# Altium project SAM3X-EK_REVB.PrjPcb (part 2 of 2)

## Sheet 03_ATSAM3X_LFBGA217.SchDoc
size 420 x 297 mm
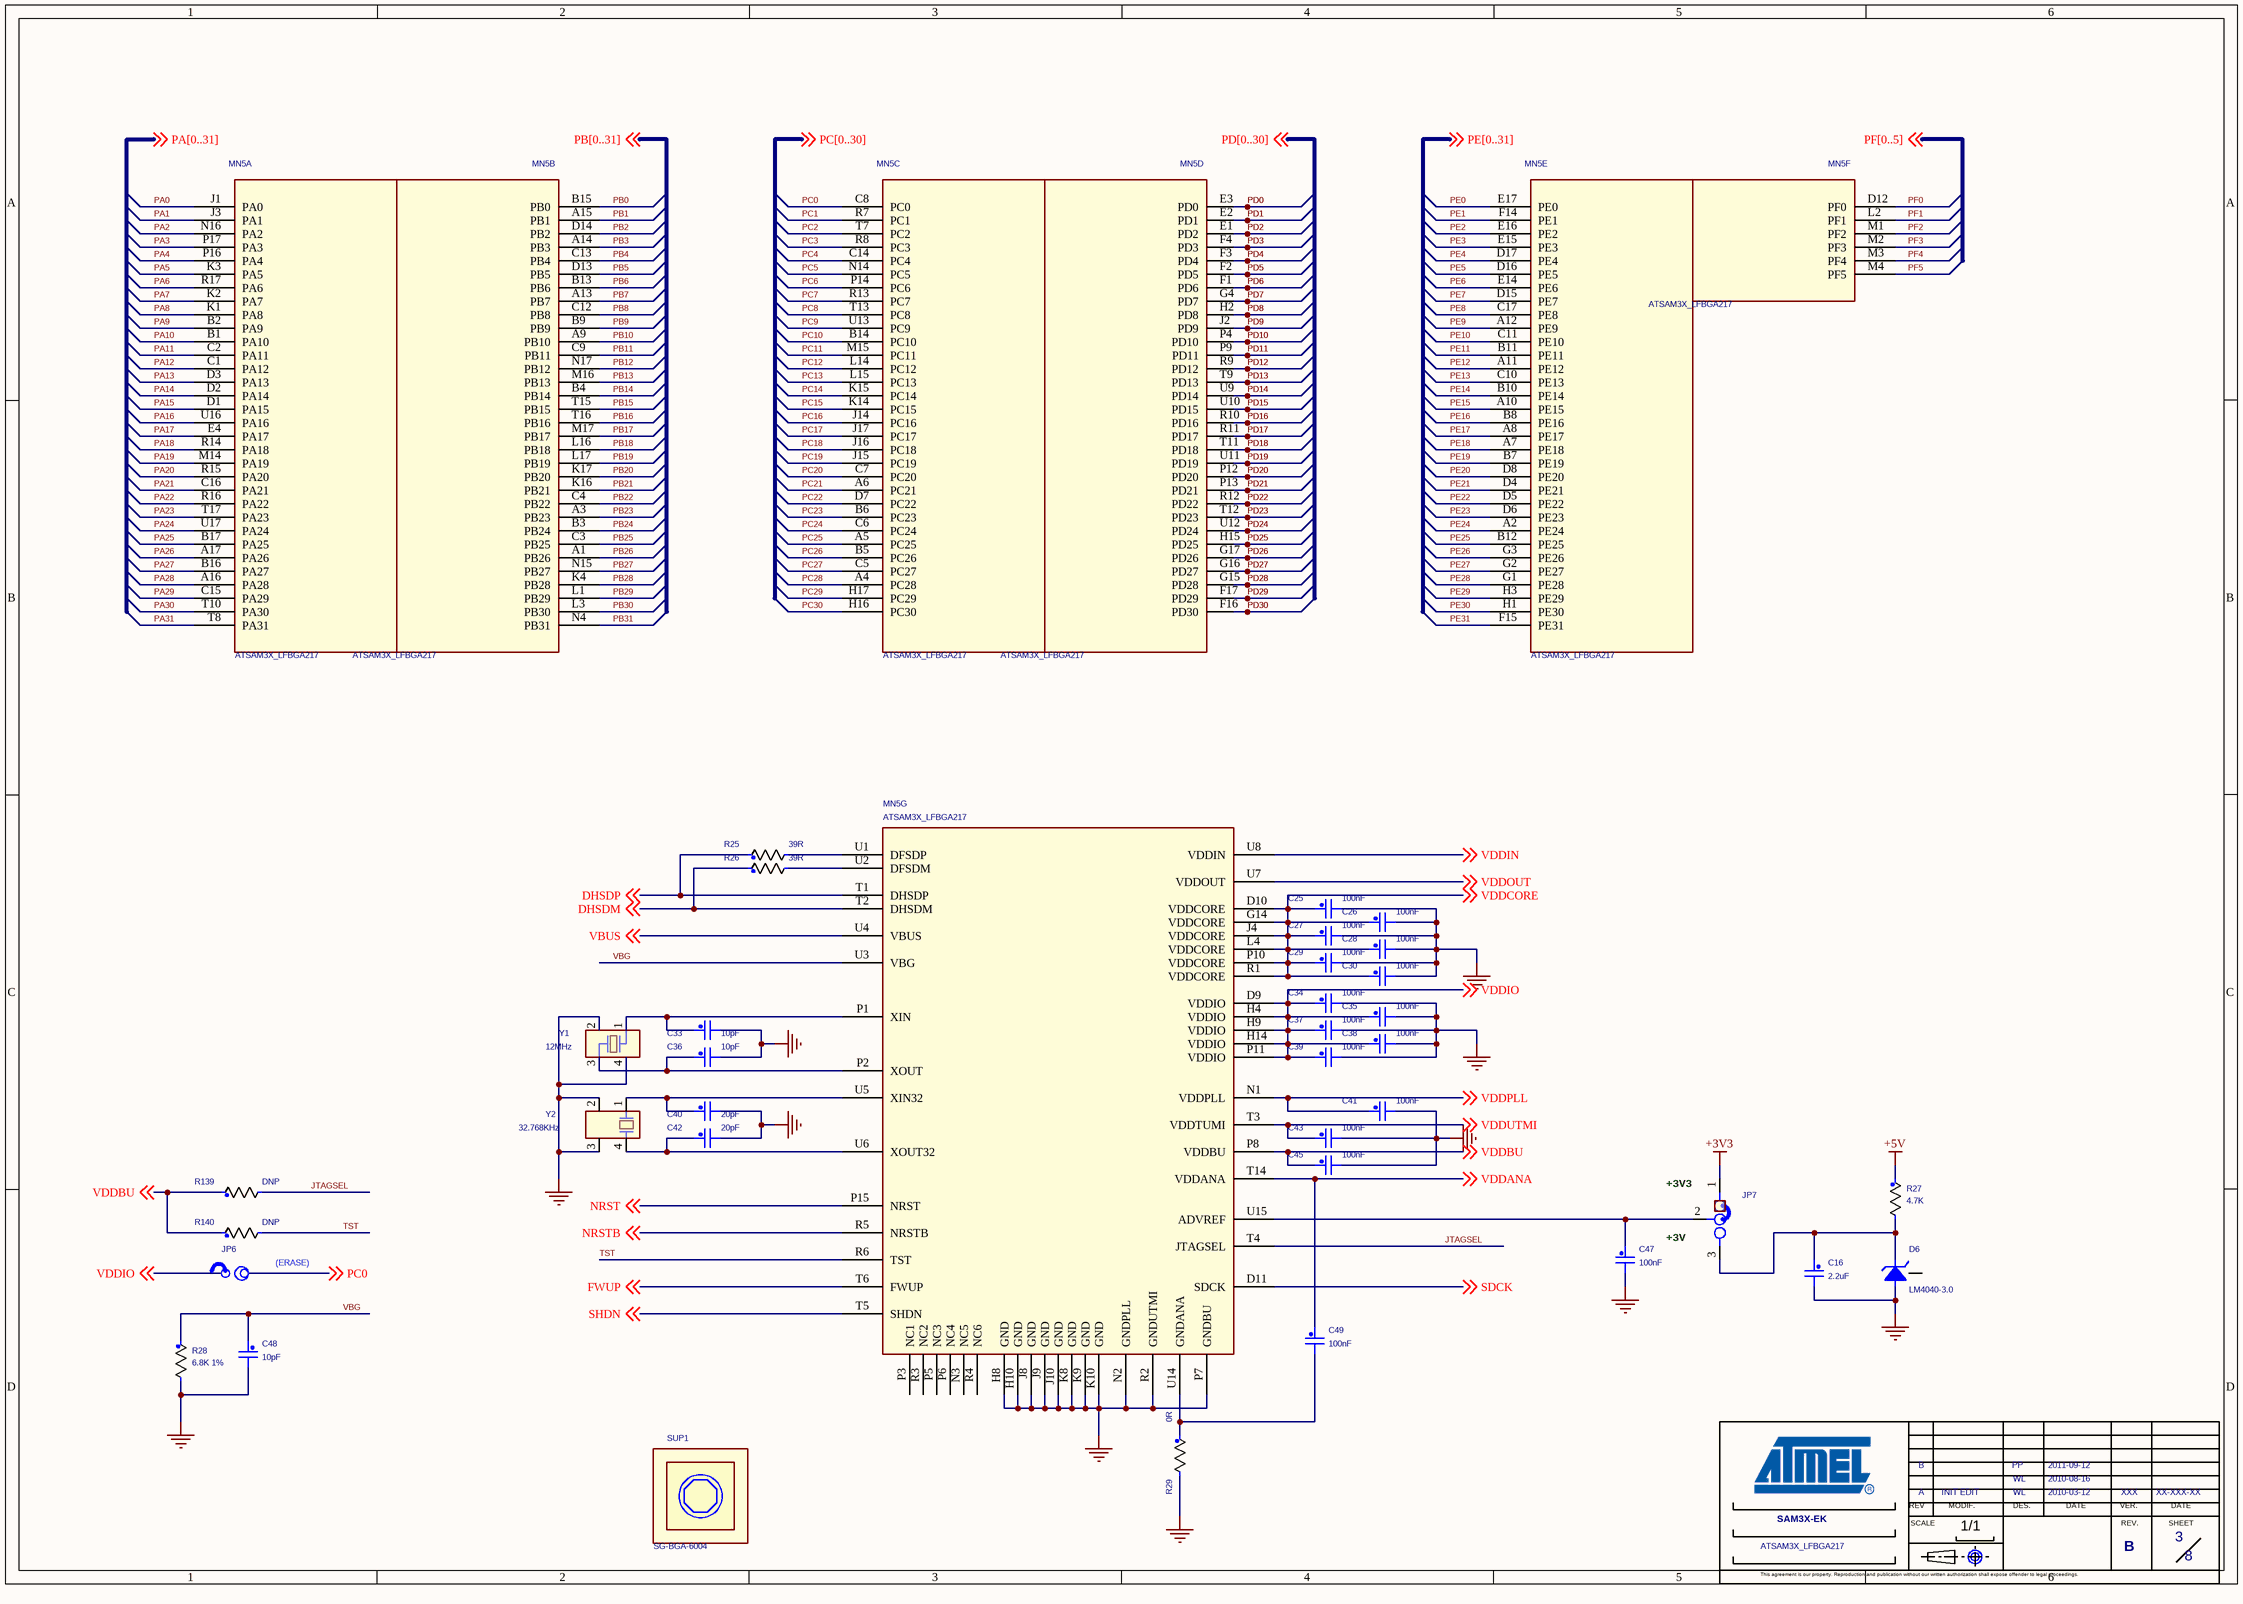
[diagram p5: 03_ATSAM3X_LFBGA217.SchDoc]

### Parts
(Parts that share a designator on the sheet are numbered #1, #2 ... from top to bottom, then left to right.)
*#6  SHEET NAME 1: ATSAM3X_LFBGA217  REV C: B  VERIF A: XXX  VERIF DATE A: XX-XXX-XX  Page Count: 8  Page Number: 3  DATE A: 2010-03-12  DATE B: 2010-08-16  DATE C: 2011-09-12  DES A: WL  DES C: PP  BOARD NAME: SAM3X-EK  VERSION: A  MODIF. DESCRIBE: INIT EDIT  (hidden comment: ATMEL ARM)  (graphical)
C16  2.2uF  [CAP0805]
C25  100nF  [CAP0805]
C26  100nF  [CAP0805]
C27  100nF  [CAP0805]
C28  100nF  [CAP0805]
C29  100nF  [CAP0805]
C30  100nF  [CAP0805]
C33  10pF  [CAP0805]
C34  100nF  [CAP0805]
C35  100nF  [CAP0805]
C36  10pF  [CAP0805]
C37  100nF  [CAP0805]
C38  100nF  [CAP0805]
C39  100nF  [CAP0805]
C40  20pF  [CAP0805]
C41  100nF  [CAP0805]
C42  20pF  [CAP0805]
C43  100nF  [CAP0805]
C45  100nF  [CAP0805]
C47  100nF  [CAP0805]
C48  10pF  [CAP0805]
C49  100nF  [CAP0805]
D6  LM4040-3.0  [SOT-23]
JP6  JP  [BAR2PTS02]  (value not drawn)
JP7  header3-100  [BAR3PTS02]  (value not drawn)
MN5  ATSAM3X_LFBGA217  [LFBGA217]  (parts A,B,C,D,E,F,G of 7)
R25  39R  [R0603]
R26  39R  [R0603]
R27  4.7K  [R0603]
R28  6.8K 1%  [R0603]
R29  0R  [r0603]
R139  DNP  [r0603]
R140  DNP  [r0603]
SH12  Jumper Pitch 2.54  [JUMPER-2.54]  (value not drawn)
SH13  Jumper Pitch 2.54  [JUMPER-2.54]  (value not drawn)
SUP1  VAL: SG-BGA-6004  (hidden comment: Support_SG-BGA-6004-MF)
Y1  12MHz  [Y6035]
Y2  32.768KHz  [9H-T7]

### Nets
+3V3: JP7.1
+5V: R27.1
GND_POWER: C16.2 C25.2 C26.2 C27.2 C28.2 C29.2 C30.2 C33.2 C34.2 C35.2 C36.2 C37.2 C38.2 C39.2 C40.2 C41.2 C42.2 C43.2 C45.2 C47.2 C48.2 D6.2(-) MN5.H8(GND) MN5.H10(GND) MN5.J8(GND) MN5.J9(GND) MN5.J10(GND) MN5.K8(GND) MN5.K9(GND) MN5.K10(GND) MN5.N2(GNDPLL) MN5.P7(GNDBU) MN5.R2(GNDUTMI) R28.2 R29.2 Y1.2 Y1.4 Y2.2 Y2.3
DHSDM: MN5.T2(DHSDM) R26.1 ; off-sheet DHSDM
DHSDP: MN5.T1(DHSDP) R25.1 ; off-sheet DHSDP
FWUP: MN5.T6(FWUP) ; off-sheet FWUP
JTAGSEL: MN5.T4(JTAGSEL) R139.2
NRST: MN5.P15(NRST) ; off-sheet NRST
NRSTB: MN5.R5(NRSTB) ; off-sheet NRSTB
PA0: MN5.J1(PA0)
PA1: MN5.J3(PA1)
PA2: MN5.N16(PA2)
PA3: MN5.P17(PA3)
PA4: MN5.P16(PA4)
PA5: MN5.K3(PA5)
PA6: MN5.R17(PA6)
PA7: MN5.K2(PA7)
PA8: MN5.K1(PA8)
PA9: MN5.B2(PA9)
PA10: MN5.B1(PA10)
PA11: MN5.C2(PA11)
PA12: MN5.C1(PA12)
PA13: MN5.D3(PA13)
PA14: MN5.D2(PA14)
PA15: MN5.D1(PA15)
PA16: MN5.U16(PA16)
PA17: MN5.E4(PA17)
PA18: MN5.R14(PA18)
PA19: MN5.M14(PA19)
PA20: MN5.R15(PA20)
PA21: MN5.C16(PA21)
PA22: MN5.R16(PA22)
PA23: MN5.T17(PA23)
PA24: MN5.U17(PA24)
PA25: MN5.B17(PA25)
PA26: MN5.A17(PA26)
PA27: MN5.B16(PA27)
PA28: MN5.A16(PA28)
PA29: MN5.C15(PA29)
PA30: MN5.T10(PA30)
PA31: MN5.T8(PA31)
PB0: MN5.B15(PB0)
PB1: MN5.A15(PB1)
PB2: MN5.D14(PB2)
PB3: MN5.A14(PB3)
PB4: MN5.C13(PB4)
PB5: MN5.D13(PB5)
PB6: MN5.B13(PB6)
PB7: MN5.A13(PB7)
PB8: MN5.C12(PB8)
PB9: MN5.B9(PB9)
PB10: MN5.A9(PB10)
PB11: MN5.C9(PB11)
PB12: MN5.N17(PB12)
PB13: MN5.M16(PB13)
PB14: MN5.B4(PB14)
PB15: MN5.T15(PB15)
PB16: MN5.T16(PB16)
PB17: MN5.M17(PB17)
PB18: MN5.L16(PB18)
PB19: MN5.L17(PB19)
PB20: MN5.K17(PB20)
PB21: MN5.K16(PB21)
PB22: MN5.C4(PB22)
PB23: MN5.A3(PB23)
PB24: MN5.B3(PB24)
PB25: MN5.C3(PB25)
PB26: MN5.A1(PB26)
PB27: MN5.N15(PB27)
PB28: MN5.K4(PB28)
PB29: MN5.L1(PB29)
PB30: MN5.L3(PB30)
PB31: MN5.N4(PB31)
PC0: JP6.1 MN5.C8(PC0) ; off-sheet PC0
PC1: MN5.R7(PC1)
PC2: MN5.T7(PC2)
PC3: MN5.R8(PC3)
PC4: MN5.C14(PC4)
PC5: MN5.N14(PC5)
PC6: MN5.P14(PC6)
PC7: MN5.R13(PC7)
PC8: MN5.T13(PC8)
PC9: MN5.U13(PC9)
PC10: MN5.B14(PC10)
PC11: MN5.M15(PC11)
PC12: MN5.L14(PC12)
PC13: MN5.L15(PC13)
PC14: MN5.K15(PC14)
PC15: MN5.K14(PC15)
PC16: MN5.J14(PC16)
PC17: MN5.J17(PC17)
PC18: MN5.J16(PC18)
PC19: MN5.J15(PC19)
PC20: MN5.C7(PC20)
PC21: MN5.A6(PC21)
PC22: MN5.D7(PC22)
PC23: MN5.B6(PC23)
PC24: MN5.C6(PC24)
PC25: MN5.A5(PC25)
PC26: MN5.B5(PC26)
PC27: MN5.C5(PC27)
PC28: MN5.A4(PC28)
PC29: MN5.H17(PC29)
PC30: MN5.H16(PC30)
PD0: MN5.E3(PD0)
PD1: MN5.E2(PD1)
PD2: MN5.E1(PD2)
PD3: MN5.F4(PD3)
PD4: MN5.F3(PD4)
PD5: MN5.F2(PD5)
PD6: MN5.F1(PD6)
PD7: MN5.G4(PD7)
PD8: MN5.H2(PD8)
PD9: MN5.J2(PD9)
PD10: MN5.P4(PD10)
PD11: MN5.P9(PD11)
PD12: MN5.R9(PD12)
PD13: MN5.T9(PD13)
PD14: MN5.U9(PD14)
PD15: MN5.U10(PD15)
PD16: MN5.R10(PD16)
PD17: MN5.R11(PD17)
PD18: MN5.T11(PD18)
PD19: MN5.U11(PD19)
PD20: MN5.P12(PD20)
PD21: MN5.P13(PD21)
PD22: MN5.R12(PD22)
PD23: MN5.T12(PD23)
PD24: MN5.U12(PD24)
PD25: MN5.H15(PD25)
PD26: MN5.G17(PD26)
PD27: MN5.G16(PD27)
PD28: MN5.G15(PD28)
PD29: MN5.F17(PD29)
PD30: MN5.F16(PD30)
PE0: MN5.E17(PE0)
PE1: MN5.F14(PE1)
PE2: MN5.E16(PE2)
PE3: MN5.E15(PE3)
PE4: MN5.D17(PE4)
PE5: MN5.D16(PE5)
PE6: MN5.E14(PE6)
PE7: MN5.D15(PE7)
PE8: MN5.C17(PE8)
PE9: MN5.A12(PE9)
PE10: MN5.C11(PE10)
PE11: MN5.B11(PE11)
PE12: MN5.A11(PE12)
PE13: MN5.C10(PE13)
PE14: MN5.B10(PE14)
PE15: MN5.A10(PE15)
PE16: MN5.B8(PE16)
PE17: MN5.A8(PE17)
PE18: MN5.A7(PE18)
PE19: MN5.B7(PE19)
PE20: MN5.D8(PE20)
PE21: MN5.D4(PE21)
PE22: MN5.D5(PE22)
PE23: MN5.D6(PE23)
PE24: MN5.A2(PE24)
PE25: MN5.B12(PE25)
PE26: MN5.G3(PE26)
PE27: MN5.G2(PE27)
PE28: MN5.G1(PE28)
PE29: MN5.H3(PE29)
PE30: MN5.H1(PE30)
PE31: MN5.F15(PE31)
PF0: MN5.D12(PF0)
PF1: MN5.L2(PF1)
PF2: MN5.M1(PF2)
PF3: MN5.M2(PF3)
PF4: MN5.M3(PF4)
PF5: MN5.M4(PF5)
SDCK: MN5.D11(SDCK) ; off-sheet SDCK
SHDN: MN5.T5(SHDN) ; off-sheet SHDN
TST: MN5.R6(TST) R140.2
VBG: C48.1 MN5.U3(VBG) R28.1
VBUS: MN5.U4(VBUS) ; off-sheet VBUS
VDDANA: C49.1 MN5.T14(VDDANA) ; off-sheet VDDANA
VDDBU: C45.1 MN5.P8(VDDBU) R139.1 R140.1 ; off-sheet VDDBU
VDDCORE: C25.1 C26.1 C27.1 C28.1 C29.1 C30.1 MN5.D10(VDDCORE) MN5.G14(VDDCORE) MN5.J4(VDDCORE) MN5.L4(VDDCORE) MN5.P10(VDDCORE) MN5.R1(VDDCORE) ; off-sheet VDDCORE
VDDIN: MN5.U8(VDDIN) ; off-sheet VDDIN
VDDIO: C34.1 C35.1 C37.1 C38.1 C39.1 JP6.2 MN5.D9(VDDIO) MN5.H4(VDDIO) MN5.H9(VDDIO) MN5.H14(VDDIO) MN5.P11(VDDIO) ; off-sheet VDDIO
VDDOUT: MN5.U7(VDDOUT) ; off-sheet VDDOUT
VDDPLL: C41.1 MN5.N1(VDDPLL) ; off-sheet VDDPLL
VDDUTMI: C43.1 MN5.T3(VDDTUMI) ; off-sheet VDDUTMI
NetC16_1: C16.1 D6.1(+) JP7.3 R27.2
NetC33_1: C33.1 MN5.P1(XIN) Y1.1
NetC36_1: C36.1 MN5.P2(XOUT) Y1.3
NetC40_1: C40.1 MN5.U5(XIN32) Y2.1
NetC42_1: C42.1 MN5.U6(XOUT32) Y2.4
NetC47_1: C47.1 JP7.2 MN5.U15(ADVREF)
NetC49_2: C49.2 MN5.U14(GNDANA) R29.1
NetMN5_U1: MN5.U1(DFSDP) R25.2
NetMN5_U2: MN5.U2(DFSDM) R26.2

Not connected (* = marked no-connect by the designer): D6 3(NC); MN5 N3(NC5) P3(NC1) P5(NC3) P6(NC4) R3(NC2) R4(NC6)

### Notes on the sheet
- (near JP7) +3V3
- (ERASE)
- (near JP7) +3V
- (in symbol ATMEL ARM) REV; MODIF.; DES.; DATE; VER.; SCALE; REV.; SHEET; 1/1; This agreement is our property. Reproduction and publication without our written authorization shall expose offender to legal proceedings.

### Library data of the parts
*#6 = ATMEL ARM: REV D: D; REV F: F; REV E: E; REV B: B; VERIF F: XXX; VERIF E: XXX; VERIF D: XXX; VERIF C: XXX; VERIF B: XXX; VERIF DATE F: XX-XXX-XX; VERIF DATE E: XX-XXX-XX; VERIF DATE D: XX-XXX-XX; VERIF DATE C: XX-XXX-XX; REV: B; VERIF DATE B: XX-XXX-XX; FT: ?; Page Size: A; Page Create Date: june 19, 2004; DATE D: XX-XXX-XX; DATE E: XX-XXX-XX; DATE F: XX-XXX-XX; DES E: XXX; DES F: XXX; DES B: WL; DES D: XXX
C16 = C_Generic: Toler.: 10%; P/N #1: C0603C104K4RAC; Voltage: 50V; Mfg #1: KEMET; Dielectric: X5R; REF: C2012X5R1C225KT; FAB: TDK; DEV: C0805; DESIG: X5R CERAMIC CAPACITOR; BOI: 0805; TOL: 10%; TEN: 50V; VAL: 2.2uF
C25 C27 C29 C35 C38 C41 C43 C49 = C_Generic: as C119 on sheet 08_SERIAL & USER INTERF; TOL: 10%; TEN: 16V; VAL: 100nF
C26 C28 C30 C34 C37 C39 C45 C47 = C_Generic: as C120 on sheet 08_SERIAL & USER INTERF; VAL: 100nF; TEN: 16V; TOL: 10%
C33 C36 C48 = C_Generic: Toler.: 10%; P/N #1: C0603C104K4RAC; Voltage: 16V; Mfg #1: KEMET; Dielectric: X7R; BOI: 0603; DESIG: Ceramic capacitor; DEV: C0603; FAB: TDK; REF: C1608X7R1H100KT; TEN: 50V; VAL: 10pF; TOL: 10%
C40 C42 = C_Generic: Toler.: 10%; P/N #1: C0603C104K4RAC; Voltage: 16V; Mfg #1: KEMET; Dielectric: X7R; TEN: 50V; REF: C1608X7R1H200KT; FAB: TDK; DEV: C0603; DESIG: Ceramic capacitor; BOI: 0603; TOL: 10%; VAL: 20pF
D6 = LM4040: Note: 0603; VAL: LM4040AIM3X-3.0; DESIG: Precision Micropower Shunt Voltage Reference; FAB: National; DEV: SOT23; REF: LM4040AIM3X-3.0; BOI: SOT23
JP6 = JUMP_0: as JP14 on sheet 08_SERIAL & USER INTERF; VAL: 045
JP7 = TSW 3PTS-DROIT_0: DESIG: Single Row Terminal Strips; BOI: TSW; FAB: SAMTEC; RoHS: YES; DEV: HEADER3-100; REF: header3-100; VAL: header3-100; PN: header3-100
R25 = R_Generic: Toler.: 1%; P/N #1: CR10-1001F-T; Mfg #1: AVX; TOL: 5%; REF: RC0603JR-0739RL; FAB: YAGEO; DESIG: RC21 5%; BOI: 0603; VAL: 39R; DEV: R0603
R26 = R_Generic: Toler.: 1%; P/N #1: CR10-1001F-T; Mfg #1: AVX; BOI: 0603; DESIG: RC21 5%; FAB: YAGEO; REF: RC0603JR-0739RL; TOL: 5%; DEV: R0603; VAL: 39R
R27 = R_Generic: P/N #1: CR10-1001F-T; BOI: 0603; DESIG: RC21 5%; FAB: YAGEO; REF: RC0603JR-074K7L; TOL: 5%; DEV: R0603; VAL: 4.7K
R28 = R_Generic: P/N #1: CR10-1001F-T; REF: RC0603FR-076K8L; FAB: YAGEO; DESIG: RC22H 1%; BOI: 0603; TOL: 1%; VAL: 6.8K; DEV: R0603
R29 = R_Generic: as R113 on sheet 08_SERIAL & USER INTERF; DEV: R0603; VAL: 0R
R139 R140 = R_Generic: P/N #1: CR10-1001F-T; TOL: 5%; VAL: NOT POPULATED; FAB: YAGEO; DESIG: RC21 5%; BOI: 0603; DEV: R0603
SH12 = JUMPER-2.54: as SH20 on sheet 08_SERIAL & USER INTERF; DESIG: 2 POINTS JUMPER PITCH 2.54; VAL: JUMPER 2.54; BOI: NA; Part Type: Jumper
SH13 = JUMPER-2.54: as SH23 on sheet 08_SERIAL & USER INTERF; DESIG: 2 POINTS JUMPER PITCH 2.54; VAL: JUMPER 2.54; BOI: NA; Part Type: Jumper
SUP1 = Support_SG-BGA-6004-MF: FAB: Ironwood Electronics; BOI: Voir Specif. Techniq; DESIG: BGA Sockets-0.8mm; REF: SG-BGA-6004-MF
Y1 = 12MHz: FAB: ECEC; REF: K12000L035
Y2 = 32.768KHz: FAB: TXC

## Sheet 02_POWER SUPPLY & USB &.SchDoc
size 420 x 297 mm
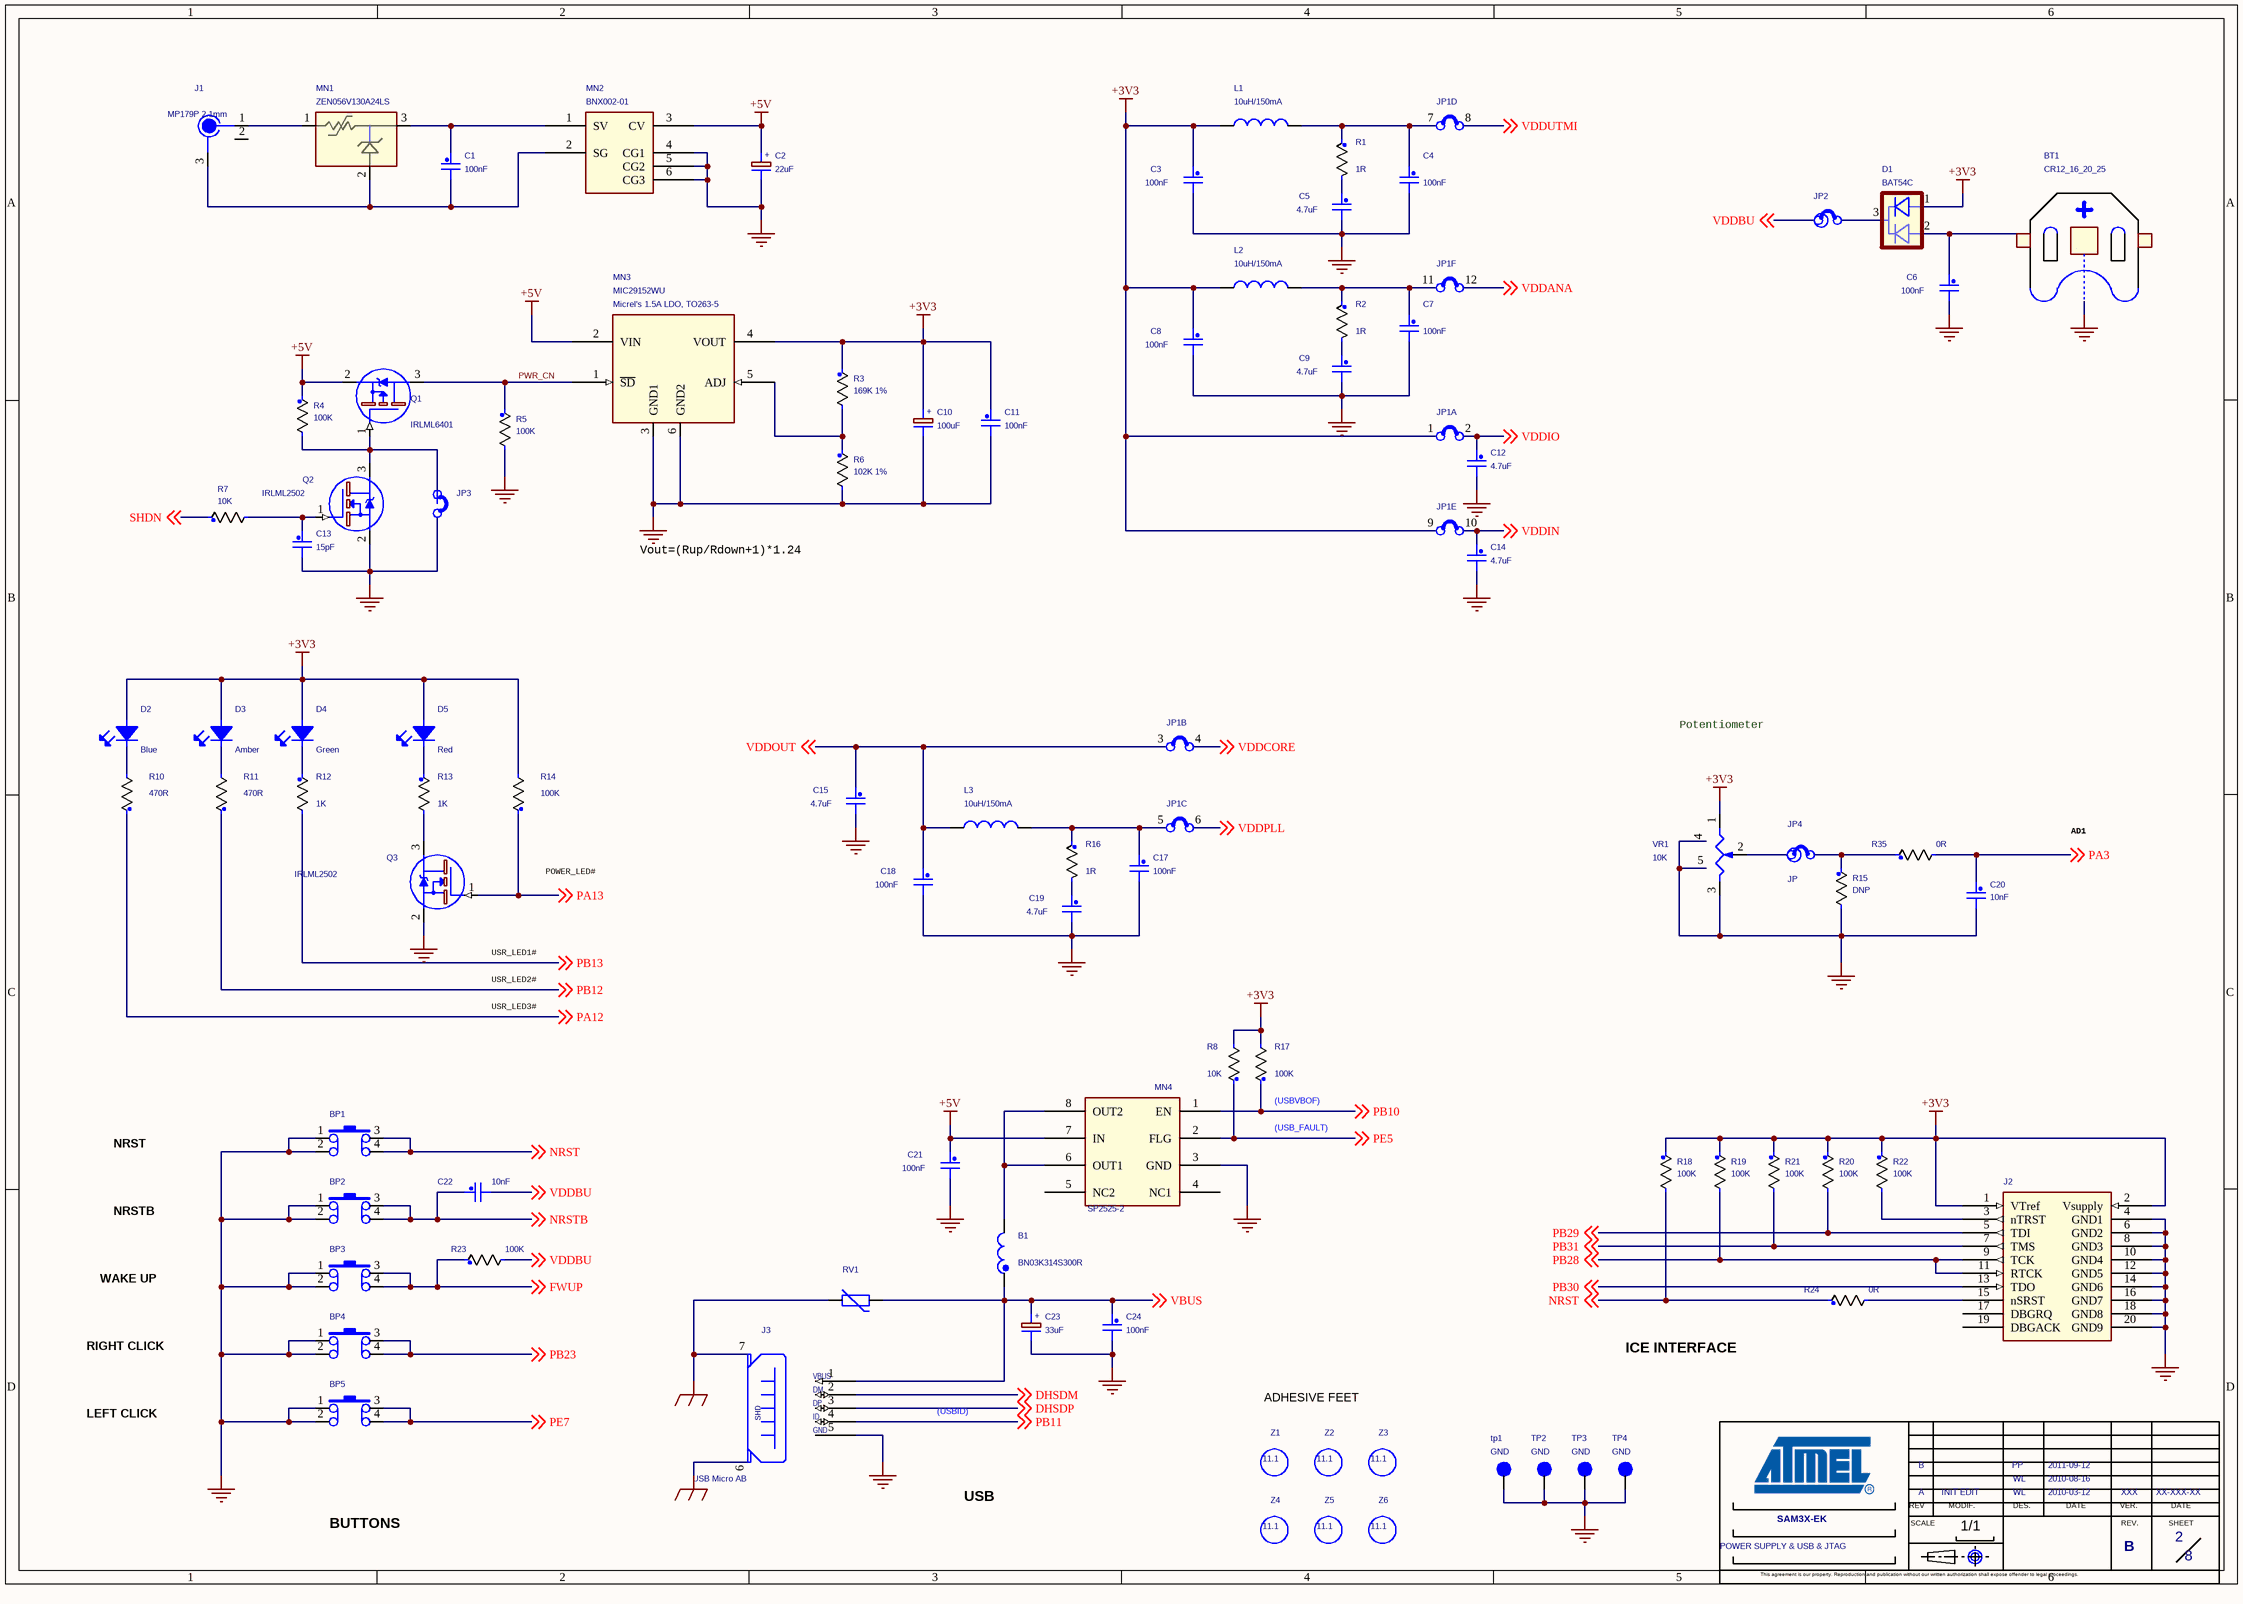
[diagram p6: 02_POWER SUPPLY & USB &.SchDoc]

### Parts
(Parts that share a designator on the sheet are numbered #1, #2 ... from top to bottom, then left to right.)
*#7  SHEET NAME 1: POWER SUPPLY & USB & JTAG  REV C: B  VERIF A: XXX  VERIF DATE A: XX-XXX-XX  Page Count: 8  Page Number: 2  DATE A: 2010-03-12  DATE B: 2010-08-16  DATE C: 2011-09-12  DES A: WL  DES C: PP  BOARD NAME: SAM3X-EK  VERSION: A  MODIF. DESCRIBE: INIT EDIT  (hidden comment: ATMEL ARM)  (graphical)
B1  BN03K314S300R  [R0603]
BP1  T062  [KEY]  (value not drawn)
BP2  T062  [KEY]  (value not drawn)
BP3  T062  [KEY]  (value not drawn)
BP4  T062  [KEY]  (value not drawn)
BP5  T062  [KEY]  (value not drawn)
BT1  CR12_16_20_25  [x-s_3000_01]
C1  100nF  [CAP0805]
C2  22uF  [C3528-21]
C3  100nF  [CAP0805]
C4  100nF  [CAP0805]
C5  4.7uF  [CAP0805]
C6  100nF  [CAP0805]
C7  100nF  [CAP0805]
C8  100nF  [CAP0805]
C9  4.7uF  [CAP0805]
C10  100uF  [C3528-21]
C11  100nF  [CAP0805]
C12  4.7uF  [CAP0805]
C13  15pF  [CAP0805]
C14  4.7uF  [CAP0805]
C15  4.7uF  [CAP0805]
C17  100nF  [CAP0805]
C18  100nF  [CAP0805]
C19  4.7uF  [CAP0805]
C20  10nF  [CAP0805]
C21  100nF  [CAP0805]
C22  10nF  [CAP0805]
C23  33uF  [C3528-21]
C24  100nF  [CAP0805]
D1  BAT54C  [SOT-23]
D2  Blue  [LED0805]
D3  Amber  [LED0805]
D4  Green  [LED0805]
D5  Red  [LED0805]
J1  VAL: MP179P 2.1mm  [CONNECT3PTS03]  (hidden comment: Jack MP179P 2.1mm)
J2  IDC20-2.54mm  [20PIN2]  (value not drawn)
J3  USB Micro AB  [usb_micro_ab]
JP1  SMT_JUMPER  [jms_tsm-2x6pts]  (value not drawn)  (parts A,B,C,D,E,F of 6)
JP2  JP  [BAR2PTS02]  (value not drawn)
JP3  JP  [BAR2PTS02]  (value not drawn)
JP4  JP  [BAR2PTS02]
L1  10uH/150mA  [NLFV25T]
L2  10uH/150mA  [NLFV25T]
L3  10uH/150mA  [NLFV25T]
MN1  ZEN056V130A24LS  [POLYZEN]
MN2  BNX002-01  [BNX001]
MN3  MIC29152WU  Note: Micrel's 1.5A LDO, TO263-5  [ADI/SM/TO263/5]
MN4  SP2525-2  [NSOIC8]
Q1  IRLML6401  [SOT23T02]
Q2  IRLML2502  [SOT23T02]
Q3  IRLML2502  [SOT23T02]
R1  1R  [R0603]
R2  1R  [R0603]
R3  169K 1%  [r0603]
R4  100K  [R0603]
R5  100K  [R0603]
R6  102K 1%  [r0603]
R7  10K  [R0603]
R8  10K  [R0603]
R10  470R  [R0603]
R11  470R  [R0603]
R12  1K  [r0603]
R13  1K  [r0603]
R14  100K  [R0603]
R15  DNP  [R0603]
R16  1R  [R0603]
R17  100K  [R0603]
R18  100K  [r0603]
R19  100K  [r0603]
R20  100K  [r0603]
R21  100K  [r0603]
R22  100K  [r0603]
R23  100K  [R0603]
R24  0R  [r0603]
R35  0R  [r0603]
RV1  VARISTOR_0603  [R0603]  (value not drawn)
SH1  Jumper Pitch 2.54  [JUMPER-2.54]  (value not drawn)
SH2  Jumper Pitch 2.54  [JUMPER-2.54]  (value not drawn)
SH3  Jumper Pitch 2.54  [JUMPER-2.54]  (value not drawn)
SH4  Jumper Pitch 2.54  [JUMPER-2.54]  (value not drawn)
SH5  Jumper Pitch 2.54  [JUMPER-2.54]  (value not drawn)
SH6  Jumper Pitch 2.54  [JUMPER-2.54]  (value not drawn)
SH8  Jumper Pitch 2.54  [JUMPER-2.54]  (value not drawn)
SH9  Jumper Pitch 2.54  [JUMPER-2.54]  (value not drawn)
SH10  Jumper Pitch 2.54  [JUMPER-2.54]  (value not drawn)
tp1  GND  [KST5012]
TP2  GND  [KST5012]
TP3  GND  [KST5012]
TP4  GND  [KST5012]
VR1  10K  [POT_3]
Z1  11.1  [TM6CIR3_2]
Z2  11.1  [TM6CIR3_2]
Z3  11.1  [TM6CIR3_2]
Z4  11.1  [TM6CIR3_2]
Z5  11.1  [TM6CIR3_2]
Z6  11.1  [TM6CIR3_2]

### Nets
+3V3: C3.1 C8.1 C10.1 C11.1 D1.1(K) D2.1(A) D3.1(A) D4.1(A) D5.1(A) J2.1(VTref) J2.2(Vsupply) JP1.1 JP1.9 L1.2 L2.2 MN3.4(VOUT) R3.1 R8.2 R14.2 R17.2 R18.1 R19.1 R20.1 R21.1 R22.1 VR1.1
+5V: C2.1 C21.1 MN2.3(CV) MN3.2(VIN) MN4.7(IN) Q1.2(S) R4.1
GND_EARTH: J3.6(SH1) J3.7(SH2) RV1.1
GND_POWER: BP1.1(T1) BP1.2(T2) BP2.1(T1) BP2.2(T2) BP3.1(T1) BP3.2(T2) BP4.1(T1) BP4.2(T2) BP5.1(T1) BP5.2(T2) BT1.1(M) C2.2 C3.2 C4.2 C5.2 C6.2 C7.2 C8.2 C9.2 C10.2 C11.2 C12.2 C13.2 C14.2 C15.2 C17.2 C18.2 C19.2 C20.2 C21.2 C23.2 C24.2 J2.4(GND1) J2.6(GND2) J2.8(GND3) J2.10(GND4) J2.12(GND5) J2.14(GND6) J2.16(GND7) J2.18(GND8) J2.20(GND9) J3.5(GND) JP3.2 MN2.4(CG1) MN2.5(CG2) MN2.6(CG3) MN3.3(GND1) MN3.6(GND2) MN4.3(GND) Q2.2(S) Q3.2(S) R5.2 R6.2 R15.2 tp1.1(TP) TP2.1(TP) TP3.1(TP) TP4.1(TP) VR1.3 VR1.4 VR1.5
DHSDM: J3.2(DM) ; off-sheet DHSDM
DHSDP: J3.3(DP) ; off-sheet DHSDP
FWUP: BP3.3(T3) BP3.4(T4) R23.1 ; off-sheet FWUP
NRST: BP1.3(T3) BP1.4(T4) R18.2 R24.1 ; off-sheet NRST
NRSTB: BP2.3(T3) BP2.4(T4) C22.1 ; off-sheet NRSTB
PA3: C20.1 R35.2 ; off-sheet PA3
PA12: R10.1 ; off-sheet PA12
PA13: Q3.1(G) R14.1 ; off-sheet PA13
PB10: MN4.1(EN) R17.1 ; off-sheet PB10
PB11: J3.4(ID) ; off-sheet PB11
PB12: R11.1 ; off-sheet PB12
PB13: R12.2 ; off-sheet PB13
PB23: BP4.3(T3) BP4.4(T4) ; off-sheet PB23
PB28: J2.9(TCK) J2.11(RTCK) R19.2 ; off-sheet PB28
PB29: J2.5(TDI) R20.2 ; off-sheet PB29
PB30: J2.13(TDO) ; off-sheet PB30
PB31: J2.7(TMS) R21.2 ; off-sheet PB31
PE5: MN4.2(FLG) R8.1 ; off-sheet PE5
PE7: BP5.3(T3) BP5.4(T4) ; off-sheet PE7
PWR_CN: MN3.1(~{SD}) Q1.3(D) R5.1
SHDN: R7.1 ; off-sheet SHDN
VBUS: B1.1 C23.1 C24.1 J3.1(VBUS) RV1.2 ; off-sheet VBUS
VDDANA: JP1.12 ; off-sheet VDDANA
VDDBU: C22.2 JP2.1 R23.2 ; off-sheet VDDBU
VDDCORE: JP1.4 ; off-sheet VDDCORE
VDDIN: C14.1 JP1.10 ; off-sheet VDDIN
VDDIO: C12.1 JP1.2 ; off-sheet VDDIO
VDDOUT: C15.1 C18.1 JP1.3 L3.2 ; off-sheet VDDOUT
VDDPLL: JP1.6 ; off-sheet VDDPLL
VDDUTMI: JP1.8 ; off-sheet VDDUTMI
NetB1_2: B1.2 MN4.6(OUT1) MN4.8(OUT2)
NetBT1_2: BT1.2(P1) C6.1 D1.2(A)
NetC1_1: C1.1 MN1.3(VOUT) MN2.1(SV)
NetC1_2: C1.2 J1.3 MN1.2(GND) MN2.2(SG)
NetC4_1: C4.1 JP1.7 L1.1 R1.1
NetC5_1: C5.1 R1.2
NetC7_1: C7.1 JP1.11 L2.1 R2.1
NetC9_1: C9.1 R2.2
NetC13_1: C13.1 Q2.1(G) R7.2
NetC17_1: C17.1 JP1.5 L3.1 R16.1
NetC19_1: C19.1 R16.2
NetD1_3: D1.3(COM) JP2.2
NetD2_2: D2.2(K) R10.2
NetD3_2: D3.2(K) R11.2
NetD4_2: D4.2(K) R12.1
NetD5_2: D5.2(K) R13.1
NetJ1_1: J1.1 MN1.1(VIN)
NetJ2_3: J2.3(nTRST) R22.2
NetJ2_15: J2.15(nSRST) R24.2
NetJP3_1: JP3.1 Q1.1(G) Q2.3(D) R4.2
NetJP4_1: JP4.1 VR1.2
NetJP4_2: JP4.2 R15.1 R35.1
NetMN3_5: MN3.5(ADJ) R3.2 R6.1
NetQ3_3: Q3.3(D) R13.2

Not connected (* = marked no-connect by the designer): BT1 3(P2); J1 2; J2 17(DBGRQ) 19(DBGACK); MN4 4(NC1) 5(NC2)

### Notes on the sheet
- Vout=(Rup/Rdown+1)*1.24
- Potentiometer
- AD1
- POWER_LED#
- (near Q3) USR_LED1#
- USR_LED2#
- USR_LED3#
- (near R17) (USBVBOF)
- (USB_FAULT)
- NRST
- NRSTB
- WAKE UP
- RIGHT CLICK
- ADHESIVE FEET
- ICE INTERFACE
- LEFT CLICK
- (USBID)
- BUTTONS
- USB
- (in symbol ATMEL ARM) REV; MODIF.; DES.; DATE; VER.; SCALE; REV.; SHEET; 1/1; This agreement is our property. Reproduction and publication without our written authorization shall expose offender to legal proceedings.
- (in symbol CAP_PN) +
- (in symbol USB_MicroAB) SHD

### Library data of the parts
*#7 = ATMEL ARM: REV D: D; REV F: F; REV E: E; REV B: B; VERIF F: XXX; VERIF E: XXX; VERIF D: XXX; VERIF C: XXX; VERIF B: XXX; VERIF DATE F: XX-XXX-XX; VERIF DATE E: XX-XXX-XX; VERIF DATE D: XX-XXX-XX; VERIF DATE C: XX-XXX-XX; REV: B; VERIF DATE B: XX-XXX-XX; FT: ?; Page Size: A; Page Create Date: june 19, 2004; DATE D: XX-XXX-XX; DATE E: XX-XXX-XX; DATE F: XX-XXX-XX; DES E: XXX; DES F: XXX; DES B: WL; DES D: XXX
B1 = BEAD: FAB: GAUSSTEK GARP; DESIG: SMD EMI Suppression Ferrite Beads; BOI: 0603; VAL: BN03K314S300R; REF: BN03K314S300R
BP1-BP5 = B3S_2: VAL: T062-507; DEV: SWS_B3S_01; FAB: KALER; BOI: L=9 l=6.0 H=4.3; DESIG: Sealed surface mount tactile switch; REF: T062-507
BT1 = Battery Holder CR12_16_20_25: Part Number: 3UQTVB-18; REF: 3000; FAB: KEYSTONE; BOI: 01-Power
C1 C3 C8 C11 C17 C18 C21 C24 = C_Generic: Toler.: 10%; P/N #1: C0603C104K4RAC; Voltage: 16V; Mfg #1: KEMET; Dielectric: X7R; BOI: 0603; DESIG: Ceramic Capacitor; DEV: C0603; FAB: TDK; REF: C1608X7R1C104KT; VAL: 100nF; TEN: 16V; TOL: 10%
C2 = CAP_PN: SDTSourceLibName: C:\WINDOWS\TEMP\SNDS.LIB; Dielectric: X5R; TOL: 10%; TEN: 16V; REF: TPSB226K016R0400; FAB: AVX; DEV: 3528; DESIG: LOW ESR TANTALUM CAPACITOR; BOI: B; VAL: 22uF
C4 C6 C7 = C_Generic: Toler.: 10%; P/N #1: C0603C104K4RAC; Voltage: 16V; Mfg #1: KEMET; Dielectric: X7R; REF: C1608X7R1C104KT; FAB: TDK; DEV: C0603; DESIG: Ceramic Capacitor; BOI: 0603; TOL: 10%; TEN: 16V; VAL: 100nF
C5 C9 C19 = C_Generic: Toler.: 10%; P/N #1: C0603C104K4RAC; Voltage: 16V; Mfg #1: KEMET; Dielectric: X5R; BOI: 0805; DESIG: X5R CERAMIC CAPACITOR; DEV: C0805; FAB: TDK; REF: C2012X5R1C475KT; VAL: 4.7uF; TEN: 16V; TOL: 10%
C10 = CAP_PN: SDTSourceLibName: C:\WINDOWS\TEMP\SNDS.LIB; TOL: 10%; TEN: 6.3V; REF: TPSB107K006R0400; FAB: AVX; DEV: 3528; DESIG: LOW ESR TANTALUM CAPACITOR; BOI: B; Dielectric: X5R; VAL: 100uF
C12 C14 C15 = C_Generic: Toler.: 10%; P/N #1: C0603C104K4RAC; Voltage: 16V; Mfg #1: KEMET; Dielectric: X5R; REF: C2012X5R1C475KT; FAB: TDK; DEV: C0805; DESIG: X5R CERAMIC CAPACITOR; BOI: 0805; TOL: 10%; TEN: 16V; VAL: 4.7uF
C13 = C_Generic: Toler.: 10%; P/N #1: C0603C104K4RAC; Voltage: 50V; Mfg #1: KEMET; Dielectric: X7R; BOI: 0603; DESIG: Ceramic Capacitor; DEV: C0603; FAB: TDK; REF: C1608X7R1H150KT; TEN: 16V; VAL: 15pF; TOL: 10%
C20 C22 = C_Generic: Toler.: 10%; P/N #1: C0603C104K4RAC; Voltage: 16V; Mfg #1: KEMET; Dielectric: X7R; BOI: 0603; DESIG: Ceramic Capacitor; DEV: C0603; FAB: TDK; REF: C1608X7R1C103KT; VAL: 10nF; TEN: 16V; TOL: 10%
C23 = CAP_PN: SDTSourceLibName: C:\WINDOWS\TEMP\SNDS.LIB; Dielectric: X5R; TOL: 10%; TEN: 16V; REF: TPSB336K016R0500; FAB: AVX; DEV: 3528; DESIG: LOW ESR TANTALUM CAPACITOR; BOI: B; VAL: 33uF
D1 = BAT54C: BOI: SOT23; DESIG: SCHOKKTY DIODE; FAB: IRF; VAL: BAT54C; REF: BAT54C
D2 = LED_Small_1: Note: 0805; VAL: HSMB-C170; FAB: AVAGO; DESIG: Chip Led Green; REF: HSMB-C170; BOI: 0805
D3 = LED_Small_1: Note: 0805; VAL: HSMA-C170; FAB: AVAGO; DESIG: Chip Led Green; REF: HSMA-C170; BOI: 0805
D4 = LED_Small_1: Note: 0805; VAL: HSMG-C170; FAB: AVAGO; DESIG: Chip Led Green; REF: HSMG-C170; BOI: 0805
D5 = LED_Small_1: Note: 0805; VAL: HSMH-C170; FAB: AVAGO; DESIG: Chip Led Green; BOI: 0805; REF: HSMH-C170
J1 = Jack: FAB: SHENZHEN YUBO; DESIG: 2.1mm Power PCB Connector; REF: 065; BOI: 2.1mmD; DEV: CONNECT3PTS03
J2 = JTAG: VAL: HE10 20PTS; DESIG: 20 PIN 2.54mm BOX HEADER; FAB: SHENZHEN SITUO; REF: HE10 20PTS
J3 = USB_MicroAB: CON,USB Micro B; Manufacturer: Tyco; REF: 1981568-1; Manufacturer Part Number: 1981568-1; Part Type: Connector; FAB: Tyco
JP1 = SMT_JUMPER: REF: TSM-2*6; FAB: SAMTEC
JP2 JP3 = JUMP_0: VAL: 045; FAB: SHENZHEN SITUO; DESIG: 2.54mm Pin Header,Single Row,Straight/Right Angle(2pin); REF: 045
JP4 = JUMP_0: DESIG: 2.54mm Pin Header,Single Row,Straight/Right Angle(2pin); FAB: SHENZHEN SITUO; REF: 045; VAL: 045
L1-L3 = L_0: DESIG: Inductor; FAB: TDK; REF: NLFV25T-100K; VAL: 10uH/150mA
MN1 = ZEN056: FAB: TYCO; DESIG: Circuit Protection; VAL: ZEN056V130A24LS; REF: ZEN056V130A24LS
MN2 = BNX002_01: DESIG: EMI FILTER; FAB: MURATA; VAL: BNX002-01; REF: BNX002-01
MN3 = LP3965ES_ADJ: FAB: MICREL; DEV: TO-263-5; DESIG: High-Current Low-Dropout Regulator; Mfg #1: NATIONAL SEMI; P/N #1: LP3965ES-ADJ; VAL: MIC29152WU; REF: MIC29152WU; BOI: TO-263-5
MN4 = SP2525-SO8_1: FAB: Sipex; REF: SP2525-2EN
Q1 = IRLML6302: PUI: 0.4W; FAB: IRF; DEV: SOT23; DESIG: P-Channel MOSFET; VAL: IRLML6401; REF: IRLML6401; BOI: SOT23
Q2 Q3 = IRLML2402: BOI: SOT23; DESIG: N-Channel MOSFET; FAB: IRF; PUI: 0.4W; DEV: SOT23; REF: IRLML2502; VAL: IRLML2502
R1 R2 = R_Generic: P/N #1: CR10-1001F-T; TOL: 5%; REF: RC0603JR-071RL; FAB: YAGEO; DESIG: RC21 5%; BOI: 0603; VAL: 1R; DEV: R0603
R3 = R_Generic: P/N #1: CR10-1001F-T; BOI: 0603; DESIG: RC22H 1%; FAB: YAGEO; REF: RC0603FR-07330RL; VAL: 330R; DEV: R0603; TOL: 1%
R4 R14 R18 R21 R22 = R_Generic: P/N #1: CR10-1001F-T; BOI: 0603; DESIG: RC21 5%; FAB: YAGEO; REF: RC0603JR-07100KL; TOL: 5%; DEV: R0603; VAL: 100K
R5 R17 R19 R20 R23 = R_Generic: P/N #1: CR10-1001F-T; TOL: 5%; REF: RC0603JR-07100KL; FAB: YAGEO; DESIG: RC21 5%; BOI: 0603; VAL: 100K; DEV: R0603
R6 = R_Generic: P/N #1: CR10-1001F-T; VAL: 200R; REF: RC0603FR-07200RL; FAB: YAGEO; DESIG: RC22H 1%; BOI: 0603; TOL: 1%; DEV: R0603
R7 R8 = R_Generic: P/N #1: CR10-1001F-T; TOL: 5%; REF: RC0603JR-0710KL; FAB: YAGEO; DESIG: RC21 5%; BOI: 0603; VAL: 10K; DEV: R0603
R10 = R_Generic: P/N #1: CR10-1001F-T; BOI: 0603; DESIG: RC21 5%; FAB: YAGEO; REF: RC0603JR-07470RL; TOL: 5%; DEV: R0603; VAL: 470R
R11 = R_Generic: P/N #1: CR10-1001F-T; TOL: 5%; REF: RC0603JR-07470RL; FAB: YAGEO; DESIG: RC21 5%; BOI: 0603; VAL: 470R; DEV: R0603
R12 R13 = R_Generic: P/N #1: CR10-1001F-T; TOL: 5%; REF: RC0603JR-071KL; FAB: YAGEO; DESIG: RC21 5%; BOI: 0603; VAL: 1K; DEV: R0603
R15 = R_Generic: P/N #1: CR10-1001F-T; BOI: 0603; DESIG: RC22H 1%; FAB: YAGEO; REF: RC0603FR-0749R9L; VAL: 49.9R; TOL: 1%; DEV: R0603
R16 = R_Generic: P/N #1: CR10-1001F-T; BOI: 0603; DESIG: RC21 5%; FAB: YAGEO; REF: RC0603JR-071RL; TOL: 5%; DEV: R0603; VAL: 1R
R24 = R_Generic: P/N #1: CR10-1001F-T; TOL: 5%; REF: RC0603JR-070RL; FAB: YAGEO; DESIG: RC21 5%; BOI: 0603; VAL: 0R; DEV: R0603
R35 = R_Generic: P/N #1: CR10-1001F-T; BOI: 0603; DESIG: RC21 5%; FAB: YAGEO; REF: RC0603JR-070RL; TOL: 5%; DEV: R0603; VAL: 0R
RV1 = VARISTOR_0603: REF: V5.5MLA0603N; VAL: V5.5MLA0603; DESIG: transient voltage surge suppression devices; BOI: 0603; FAB: LITTELFUSE; REUSE_ANNOTATE: TRUE
SH1-SH3 SH5 SH6 SH8 SH10 = JUMPER-2.54: Jumper,2 Points Jumper Pitch 2.54; Part Number: 440-00002-1; Manufacturer: WIESON; Manufacturer Part Number: G4160-1A60BF1U; FAB: NA; REF: JUMPER 2.54; DESIG: 2 POINTS JUMPER PITCH 2.54; VAL: JUMPER 2.54; BOI: NA; Part Type: Jumper
SH4 SH9 = JUMPER-2.54: Jumper,2 Points Jumper Pitch 2.54; Manufacturer Part Number: G4160-1A60BF1U; Manufacturer: WIESON; Part Number: 440-00002-1; FAB: NA; REF: JUMPER 2.54; DESIG: 2 POINTS JUMPER PITCH 2.54; VAL: JUMPER 2.54; BOI: NA; Part Type: Jumper
tp1 TP3 = TP: REF: 5012; VAL: testing needle; FAB: keystone
TP2 TP4 = TP: FAB: keystone; VAL: testing needle; REF: 5012
VR1 = POT2: REF: WH9011-1-F; FAB: XINZE; DESIG: Potentiometer; VAL: 10K
Z1-Z6 = PIED ADHESIF 11.1mm: VAL: RBS-2; DESIG: BUMPERS; BOI: NA; FAB: RICHCO; RoHS: YES; REF: RBS-2

## Sheet 01_TOP LEVEL.SchDoc
size 420 x 297 mm
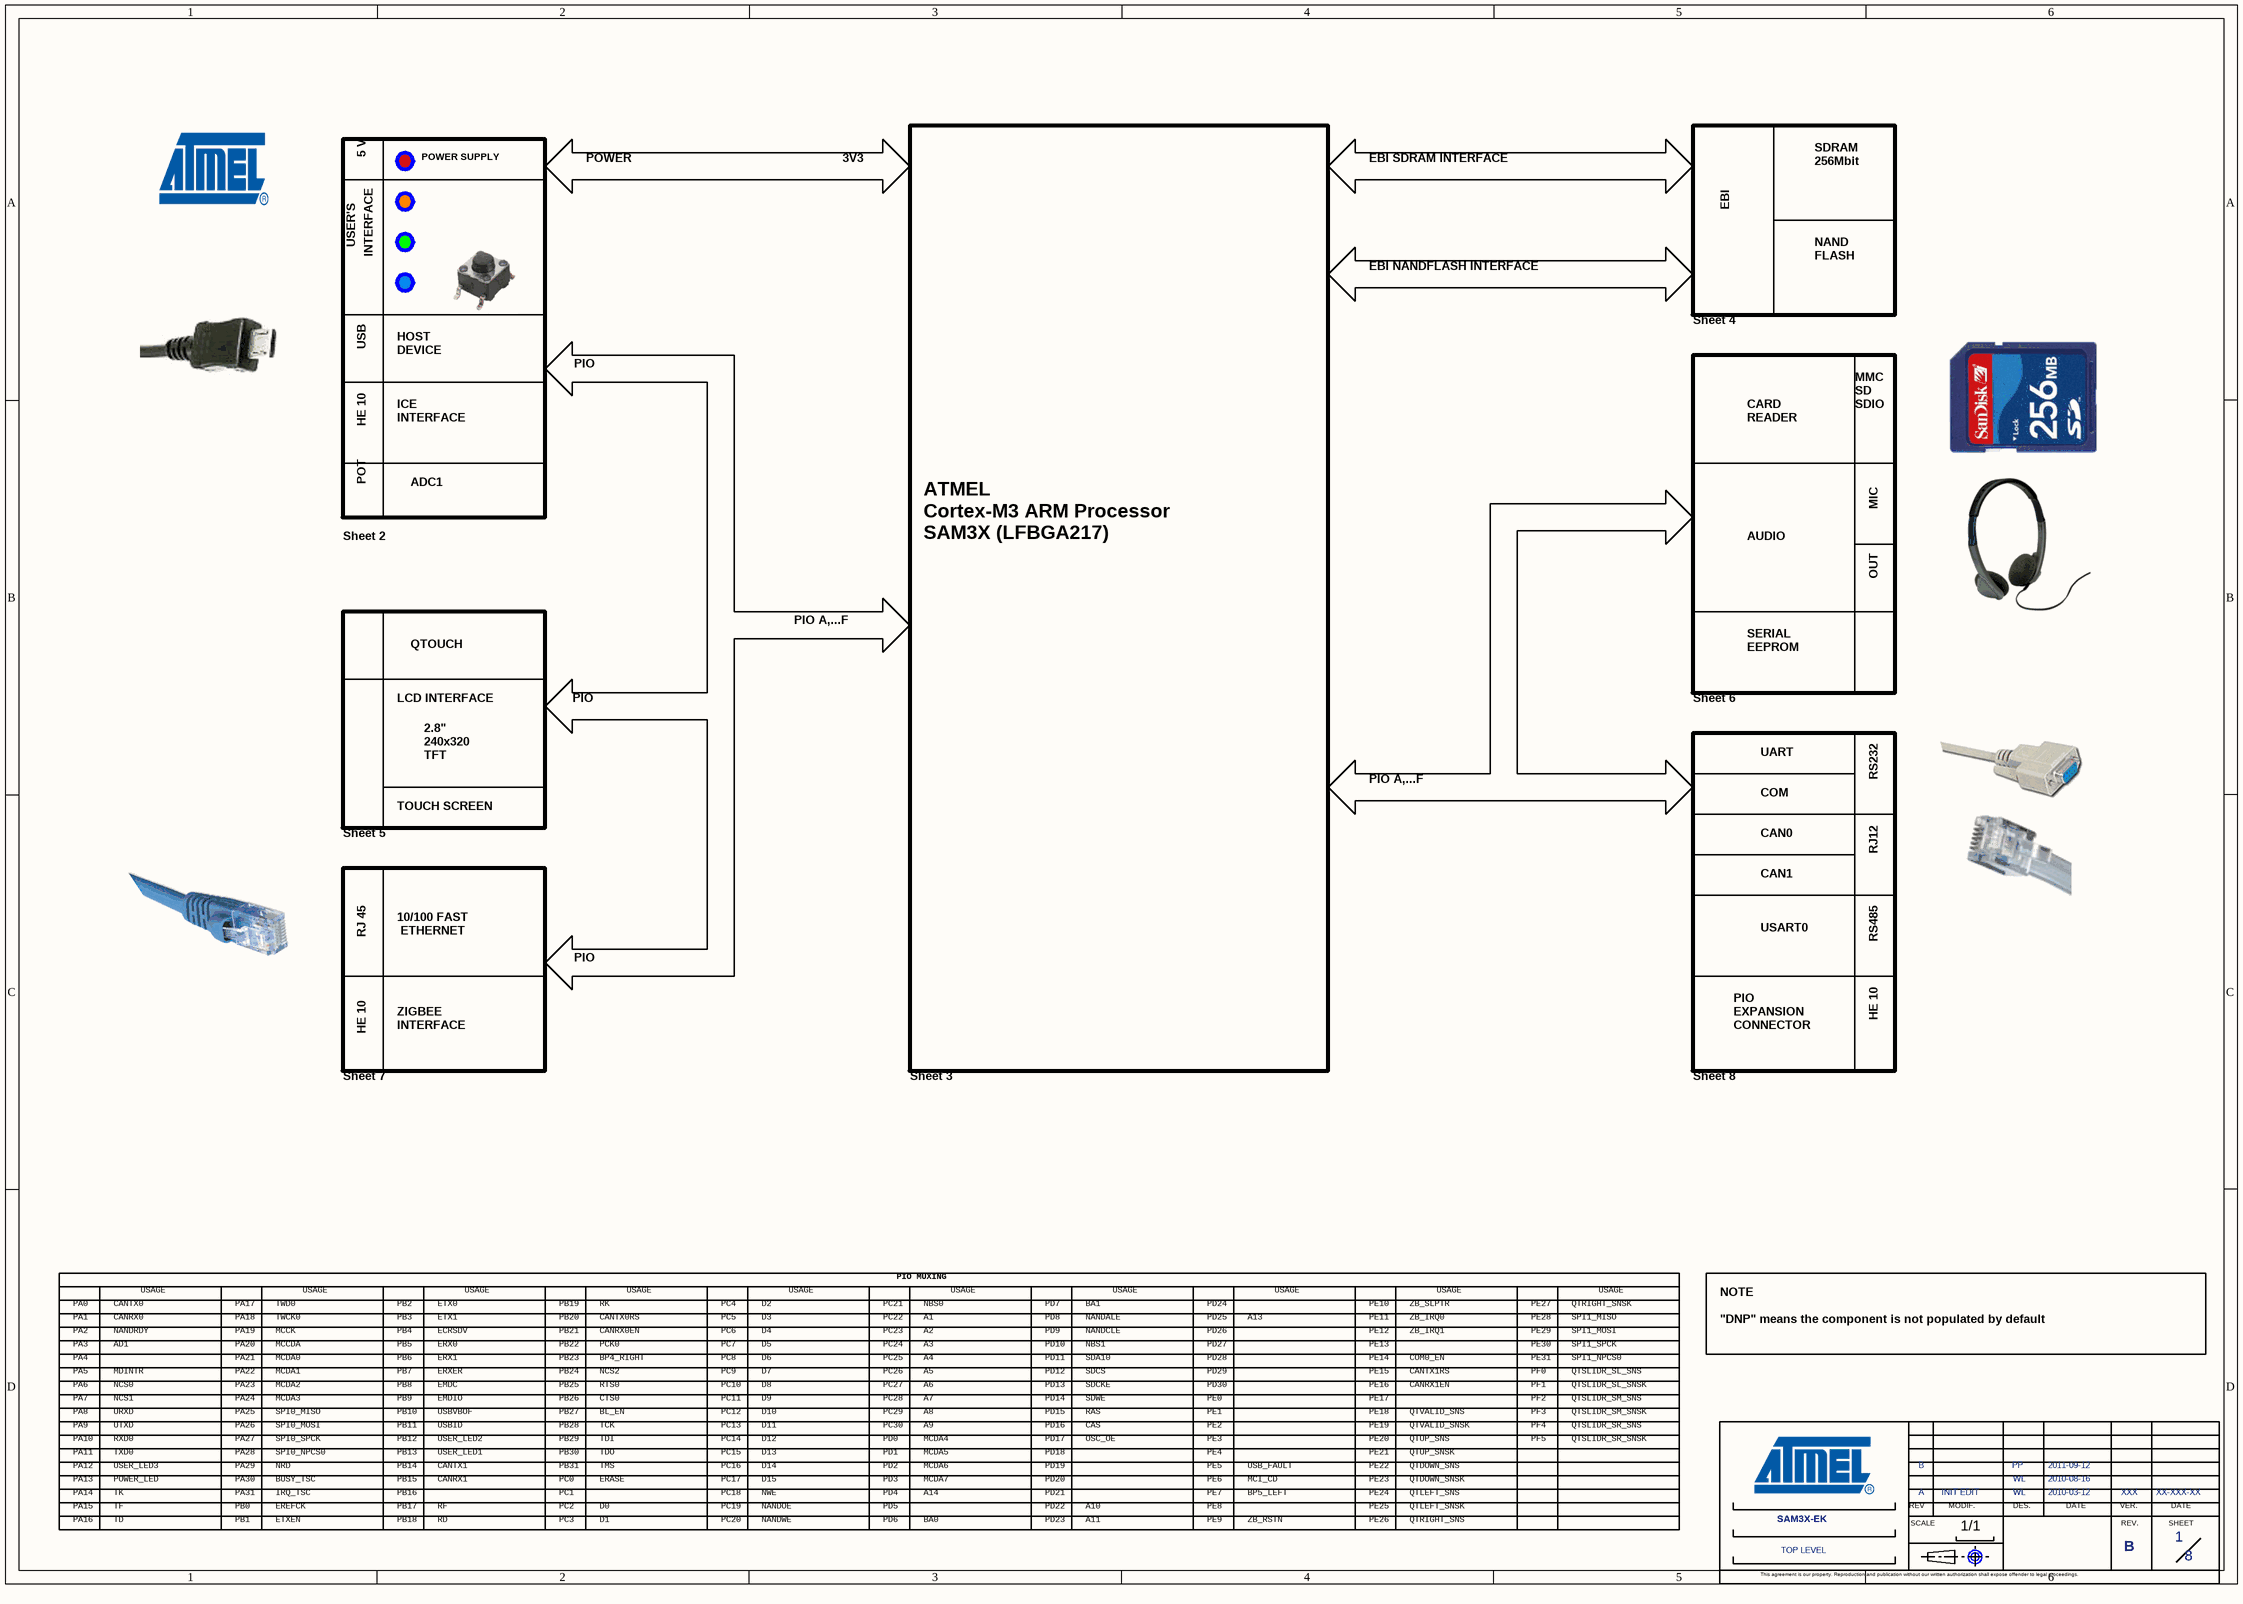
[diagram p7: 01_TOP LEVEL.SchDoc]

### Parts
(Parts that share a designator on the sheet are numbered #1, #2 ... from top to bottom, then left to right.)
*#8  SHEET NAME 1: TOP LEVEL  REV C: B  VERIF A: XXX  VERIF DATE A: XX-XXX-XX  Page Count: 8  Page Number: 1  DATE A: 2010-03-12  DATE B: 2010-08-16  DATE C: 2011-09-12  DES A: WL  DES C: PP  BOARD NAME: SAM3X-EK  VERSION: A  MODIF. DESCRIBE: INIT EDIT  (hidden comment: ATMEL ARM)  (graphical)

### Notes on the sheet
- 5 V
- POWER SUPPLY
- POWER
- 3V3
- EBI SDRAM INTERFACE
- SDRAM
  256Mbit
- USER'S
- INTERFACE
- EBI
- NAND
  FLASH
- HOST
  DEVICE
- EBI NANDFLASH INTERFACE
- Sheet 4
- USB
- ICE
  INTERFACE
- PIO
- CARD
  READER
- MMC SD
  SDIO
- HE 10
- POT
- ADC1
- ATMEL
  Cortex-M3 ARM Processor
  SAM3X (LFBGA217)
- MIC
- Sheet 2
- AUDIO
- OUT
- QTOUCH
- PIO A,...F
- SERIAL
  EEPROM
- LCD INTERFACE
- 2.8"
  240x320
  TFT
- Sheet 6
- UART
- COM
- RS232
- Sheet 5
- TOUCH SCREEN
- CAN0
- RJ12
- RJ 45
- 10/100 FAST
  ETHERNET
- CAN1
- USART0
- RS485
- ZIGBEE
  INTERFACE
- PIO
  EXPANSION
  CONNECTOR
- Sheet 7
- Sheet 3
- Sheet 8
- PA0
- PA1
- PA2
- NANDRDY
- CANTX0
- CANRX0
- USAGE
- PA17
- PA18
- PA19
- MCCK
- TWD0
- TWCK0
- PB2
- PB3
- PB4
- ETX0
- ETX1
- ECRSDV
- PB19
- PB20
- PB21
- RK
- CANTX0RS
- CANRX0EN
- PC4
- PC5
- PC6
- D2
- D3
- D4
- PC21
- PC22
- PC23
- PIO MUXING
- A1
- A2
- NBS0
- PD7
- PD8
- PD9
- NANDALE
- NANDCLE
- BA1
- PD24
- PD25
- PD26
- A13
- PE10
- PE11
- PE12
- ZB_SLPTR
- ZB_IRQ0
- ZB_IRQ1
- PE27
- PE28
- PE29
- SPI1_MISO
- SPI1_MOSI
- QTRIGHT_SNSK
- "DNP" means the component is not populated by default
- NOTE
- PA3
- PA4
- PA5
- PA6
- PA7
- NCS1
- NCS0
- MDINTR
- AD1
- PA20
- PA21
- PA22
- PA23
- PA24
- MCCDA
- MCDA0
- MCDA2
- MCDA1
- MCDA3
- PB5
- PB6
- PB7
- PB8
- PB9
- ERX0
- ERX1
- ERXER
- EMDC
- EMDIO
- PB22
- PB23
- PB24
- PB25
- PB26
- PCK0
- NCS2
- RTS0
- CTS0
- BP4_RIGHT
- PC7
- PC8
- PC9
- PC10
- PC11
- D5
- D6
- D7
- D8
- D9
- PC24
- PC25
- PC26
- PC27
- PC28
- A3
- A4
- A5
- A6
- A7
- PD10
- PD11
- PD12
- PD13
- PD14
- SDA10
- SDCKE
- NBS1
- SDWE
- SDCS
- PE0
- PD27
- PD28
- PD29
- PD30
- PE13
- PE14
- PE15
- PE16
- PE17
- COM0_EN
- CANTX1RS
- CANRX1EN
- PE30
- PE31
- PF0
- PF1
- PF2
- SPI1_SPCK
- SPI1_NPCS0
- QTSLIDR_SL_SNS
- QTSLIDR_SL_SNSK
- QTSLIDR_SM_SNS
- PA8
- PA9
- PA10
- PA11
- PA12
- URXD
- UTXD
- RXD0
- TXD0
- USER_LED3
- PA25
- PA26
- PA27
- PA28
- PA29
- SPI0_MISO
- SPI0_MOSI
- SPI0_SPCK
- SPI0_NPCS0
- NRD
- PB10
- PB11
- PB12
- PB13
- PB14
- USBVBOF
- USBID
- CANTX1
- USER_LED1
- USER_LED2
- PB27
- PB28
- PB29
- PB30
- PB31
- TCK
- TDI
- TDO
- TMS
- BL_EN
- PC12
- PC13
- PC14
- PC15
- PC16
- D10
- D11
- D12
- D13
- D14
- PD0
- PD1
- PD2
- PC29
- PC30
- MCDA4
- MCDA5
- MCDA6
- A8
- A9
- PD15
- PD16
- PD17
- PD18
- PD19
- CAS
- RAS
- OSC_OE
- PE1
- PE2
- PE3
- PE4
- PE5
- USB_FAULT
- PE18
- PE19
- PE20
- PE21
- PE22
- QTVALID_SNS
- QTVALID_SNSK
- QTUP_SNS
- QTUP_SNSK
- QTDOWN_SNS
- PF3
- PF4
- PF5
- QTSLIDR_SM_SNSK
- QTSLIDR_SR_SNS
- QTSLIDR_SR_SNSK
- PA13
- PA14
- PA15
- PA16
- TK
- TF
- TD
- POWER_LED
- PB0
- PB1
- PA30
- PA31
- EREFCK
- ETXEN
- IRQ_TSC
- BUSY_TSC
- PB15
- PB16
- PB17
- PB18
- RF
- RD
- CANRX1
- PC0
- PC1
- PC2
- PC3
- D0
- D1
- ERASE
- PC17
- PC18
- PC19
- PC20
- NWE
- D15
- NANDOE
- NANDWE
- PD3
- PD4
- PD5
- PD6
- MCDA7
- A14
- BA0
- PD20
- PD21
- PD22
- PD23
- A10
- A11
- PE6
- PE7
- PE8
- PE9
- ZB_RSTN
- BP5_LEFT
- MCI_CD
- PE23
- PE24
- PE25
- PE26
- QTDOWN_SNSK
- QTLEFT_SNS
- QTLEFT_SNSK
- QTRIGHT_SNS
- (in symbol ATMEL ARM) REV; MODIF.; DES.; DATE; VER.; SCALE; REV.; SHEET; 1/1; This agreement is our property. Reproduction and publication without our written authorization shall expose offender to legal proceedings.

### Library data of the parts
*#8 = ATMEL ARM: REV D: D; REV F: F; REV E: E; REV B: B; VERIF F: XXX; VERIF E: XXX; VERIF D: XXX; VERIF C: XXX; VERIF B: XXX; VERIF DATE F: XX-XXX-XX; VERIF DATE E: XX-XXX-XX; VERIF DATE D: XX-XXX-XX; VERIF DATE C: XX-XXX-XX; REV: B; VERIF DATE B: XX-XXX-XX; FT: ?; Page Size: A; Page Create Date: june 19, 2004; DATE D: XX-XXX-XX; DATE E: XX-XXX-XX; DATE F: XX-XXX-XX; DES E: XXX; DES F: XXX; DES B: WL; DES D: XXX

## Nets that join several sheets
+3V3: 08_SERIAL & USER INTERF (40 pins), 07_ETHERNET & ZIGBEE (23 pins), 06_Audio & HSMCI & TWI (28 pins), 05_DISPLAY & QTouch (10 pins), 04_EBI_MEMORY (23 pins), 03_ATSAM3X_LFBGA217 (JP7.1), 02_POWER SUPPLY & USB & (26 pins)
+5V: 08_SERIAL & USER INTERF (5 pins), 03_ATSAM3X_LFBGA217 (R27.1), 02_POWER SUPPLY & USB & (7 pins)
GND_EARTH: 08_SERIAL & USER INTERF (5 pins), 07_ETHERNET & ZIGBEE (5 pins), 02_POWER SUPPLY & USB & (J3.6 J3.7 RV1.1)
GND_POWER: 08_SERIAL & USER INTERF (46 pins), 07_ETHERNET & ZIGBEE (29 pins), 06_Audio & HSMCI & TWI (19 pins), 05_DISPLAY & QTouch (11 pins), 04_EBI_MEMORY (21 pins), 03_ATSAM3X_LFBGA217 (39 pins), 02_POWER SUPPLY & USB & (61 pins)
DHSDM: 03_ATSAM3X_LFBGA217 (MN5.T2 R26.1), 02_POWER SUPPLY & USB & (J3.2)
DHSDP: 03_ATSAM3X_LFBGA217 (MN5.T1 R25.1), 02_POWER SUPPLY & USB & (J3.3)
FWUP: 03_ATSAM3X_LFBGA217 (MN5.T6), 02_POWER SUPPLY & USB & (BP3.3 BP3.4 R23.1)
NRST: 07_ETHERNET & ZIGBEE (MN19.3 R87.2), 05_DISPLAY & QTouch (J4.24), 03_ATSAM3X_LFBGA217 (MN5.P15), 02_POWER SUPPLY & USB & (BP1.3 BP1.4 R18.2 R24.1)
NRSTB: 03_ATSAM3X_LFBGA217 (MN5.R5), 02_POWER SUPPLY & USB & (BP2.3 BP2.4 C22.1)
PA0: 08_SERIAL & USER INTERF (J15.5 R127.1), 03_ATSAM3X_LFBGA217 (MN5.J1)
PA1: 08_SERIAL & USER INTERF (J15.7 R130.1), 03_ATSAM3X_LFBGA217 (MN5.J3)
PA2: 08_SERIAL & USER INTERF (J15.9), 04_EBI_MEMORY (R32.1), 03_ATSAM3X_LFBGA217 (MN5.N16)
PA3: 08_SERIAL & USER INTERF (J15.11), 03_ATSAM3X_LFBGA217 (MN5.P17), 02_POWER SUPPLY & USB & (C20.1 R35.2)
PA4: 08_SERIAL & USER INTERF (J15.13), 03_ATSAM3X_LFBGA217 (MN5.P16)
PA5: 08_SERIAL & USER INTERF (J15.15), 07_ETHERNET & ZIGBEE (MN13.32 RR4.8), 03_ATSAM3X_LFBGA217 (MN5.K3)
PA6: 08_SERIAL & USER INTERF (J15.17), 04_EBI_MEMORY (JP8.2), 03_ATSAM3X_LFBGA217 (MN5.R17)
PA7: 08_SERIAL & USER INTERF (J15.19), 03_ATSAM3X_LFBGA217 (MN5.K2)
PA8: 08_SERIAL & USER INTERF (J15.21 MN14.12), 03_ATSAM3X_LFBGA217 (MN5.K1)
PA9: 08_SERIAL & USER INTERF (J15.23 MN14.11 R111.2), 03_ATSAM3X_LFBGA217 (MN5.B2)
PA10: 08_SERIAL & USER INTERF (J15.25 R109.1 R121.1), 03_ATSAM3X_LFBGA217 (MN5.B1)
PA11: 08_SERIAL & USER INTERF (J15.27 R114.1 R120.1), 03_ATSAM3X_LFBGA217 (MN5.C2)
PA12: 08_SERIAL & USER INTERF (J15.29), 03_ATSAM3X_LFBGA217 (MN5.C1), 02_POWER SUPPLY & USB & (R10.1)
PA13: 08_SERIAL & USER INTERF (J15.31), 03_ATSAM3X_LFBGA217 (MN5.D3), 02_POWER SUPPLY & USB & (Q3.1 R14.1)
PA14: 08_SERIAL & USER INTERF (J15.33), 06_Audio & HSMCI & TWI (R71.1), 03_ATSAM3X_LFBGA217 (MN5.D2)
PA15: 08_SERIAL & USER INTERF (J15.35), 06_Audio & HSMCI & TWI (MN11.5), 03_ATSAM3X_LFBGA217 (MN5.D1)
PA16: 08_SERIAL & USER INTERF (J15.6), 06_Audio & HSMCI & TWI (MN11.4), 03_ATSAM3X_LFBGA217 (MN5.U16)
PA17: 08_SERIAL & USER INTERF (J15.8), 06_Audio & HSMCI & TWI (MN11.23 MN12.5 R64.2), 03_ATSAM3X_LFBGA217 (MN5.E4)
PA18: 08_SERIAL & USER INTERF (J15.10), 06_Audio & HSMCI & TWI (MN11.24 MN12.6 R66.2), 03_ATSAM3X_LFBGA217 (MN5.R14)
PA19: 08_SERIAL & USER INTERF (J15.12), 06_Audio & HSMCI & TWI (J8.8), 03_ATSAM3X_LFBGA217 (MN5.M14)
PA20: 08_SERIAL & USER INTERF (J15.14), 06_Audio & HSMCI & TWI (J8.4 R80.2), 03_ATSAM3X_LFBGA217 (MN5.R15)
PA21: 08_SERIAL & USER INTERF (J15.16), 06_Audio & HSMCI & TWI (J8.12 RR2.6), 03_ATSAM3X_LFBGA217 (MN5.C16)
PA22: 08_SERIAL & USER INTERF (J15.18), 06_Audio & HSMCI & TWI (J8.13 RR2.5), 03_ATSAM3X_LFBGA217 (MN5.R16)
PA23: 08_SERIAL & USER INTERF (J15.20), 06_Audio & HSMCI & TWI (J8.1 RR1.8), 03_ATSAM3X_LFBGA217 (MN5.T17)
PA24: 08_SERIAL & USER INTERF (J15.22), 06_Audio & HSMCI & TWI (J8.2 RR1.7), 03_ATSAM3X_LFBGA217 (MN5.U17)
PA25: 08_SERIAL & USER INTERF (J15.24), 05_DISPLAY & QTouch (MN9.12), 03_ATSAM3X_LFBGA217 (MN5.B17)
PA26: 08_SERIAL & USER INTERF (J15.26), 05_DISPLAY & QTouch (MN9.14), 03_ATSAM3X_LFBGA217 (MN5.A17)
PA27: 08_SERIAL & USER INTERF (J15.28), 05_DISPLAY & QTouch (MN9.16), 03_ATSAM3X_LFBGA217 (MN5.B16)
PA28: 08_SERIAL & USER INTERF (J15.30), 05_DISPLAY & QTouch (R51.2), 03_ATSAM3X_LFBGA217 (MN5.A16)
PA29: 08_SERIAL & USER INTERF (J15.32), 05_DISPLAY & QTouch (J4.5), 03_ATSAM3X_LFBGA217 (MN5.C15)
PA30: 08_SERIAL & USER INTERF (J15.34), 05_DISPLAY & QTouch (R52.2), 03_ATSAM3X_LFBGA217 (MN5.T10)
PA31: 08_SERIAL & USER INTERF (J15.36), 05_DISPLAY & QTouch (R53.2), 03_ATSAM3X_LFBGA217 (MN5.T8)
PB0: 08_SERIAL & USER INTERF (J16.5), 07_ETHERNET & ZIGBEE (R86.1), 03_ATSAM3X_LFBGA217 (MN5.B15)
PB1: 08_SERIAL & USER INTERF (J16.7), 07_ETHERNET & ZIGBEE (MN13.21), 03_ATSAM3X_LFBGA217 (MN5.A15)
PB2: 08_SERIAL & USER INTERF (J16.9), 07_ETHERNET & ZIGBEE (MN13.20), 03_ATSAM3X_LFBGA217 (MN5.D14)
PB3: 08_SERIAL & USER INTERF (J16.11), 07_ETHERNET & ZIGBEE (MN13.19), 03_ATSAM3X_LFBGA217 (MN5.A14)
PB4: 08_SERIAL & USER INTERF (J16.13), 07_ETHERNET & ZIGBEE (MN13.37 RR5.7 RR5.8), 03_ATSAM3X_LFBGA217 (MN5.C13)
PB5: 08_SERIAL & USER INTERF (J16.15), 07_ETHERNET & ZIGBEE (MN13.29 RR3.5), 03_ATSAM3X_LFBGA217 (MN5.D13)
PB6: 08_SERIAL & USER INTERF (J16.17), 07_ETHERNET & ZIGBEE (MN13.28 RR3.6), 03_ATSAM3X_LFBGA217 (MN5.B13)
PB7: 08_SERIAL & USER INTERF (J16.19), 07_ETHERNET & ZIGBEE (MN13.38 RR5.6), 03_ATSAM3X_LFBGA217 (MN5.A13)
PB8: 08_SERIAL & USER INTERF (J16.21), 07_ETHERNET & ZIGBEE (MN13.24), 03_ATSAM3X_LFBGA217 (MN5.C12)
PB9: 08_SERIAL & USER INTERF (J16.23), 07_ETHERNET & ZIGBEE (MN13.25 R93.2), 03_ATSAM3X_LFBGA217 (MN5.B9)
PB10: 08_SERIAL & USER INTERF (J16.25), 03_ATSAM3X_LFBGA217 (MN5.A9), 02_POWER SUPPLY & USB & (MN4.1 R17.1)
PB11: 08_SERIAL & USER INTERF (J16.27), 03_ATSAM3X_LFBGA217 (MN5.C9), 02_POWER SUPPLY & USB & (J3.4)
PB12: 08_SERIAL & USER INTERF (J16.29), 03_ATSAM3X_LFBGA217 (MN5.N17), 02_POWER SUPPLY & USB & (R11.1)
PB13: 08_SERIAL & USER INTERF (J16.31), 03_ATSAM3X_LFBGA217 (MN5.M16), 02_POWER SUPPLY & USB & (R12.2)
PB14: 08_SERIAL & USER INTERF (J16.33 R133.1), 03_ATSAM3X_LFBGA217 (MN5.B4)
PB15: 08_SERIAL & USER INTERF (J16.35 R137.1), 03_ATSAM3X_LFBGA217 (MN5.T15)
PB16: 08_SERIAL & USER INTERF (J16.6), 03_ATSAM3X_LFBGA217 (MN5.T16)
PB17: 08_SERIAL & USER INTERF (J16.8), 06_Audio & HSMCI & TWI (R74.1), 03_ATSAM3X_LFBGA217 (MN5.M17)
PB18: 08_SERIAL & USER INTERF (J16.10), 06_Audio & HSMCI & TWI (R73.1), 03_ATSAM3X_LFBGA217 (MN5.L16)
PB19: 08_SERIAL & USER INTERF (J16.12), 06_Audio & HSMCI & TWI (R72.1), 03_ATSAM3X_LFBGA217 (MN5.L17)
PB20: 08_SERIAL & USER INTERF (J16.14 R126.1), 03_ATSAM3X_LFBGA217 (MN5.K17)
PB21: 08_SERIAL & USER INTERF (J16.16 R129.1), 03_ATSAM3X_LFBGA217 (MN5.K16)
PB22: 08_SERIAL & USER INTERF (J16.18), 06_Audio & HSMCI & TWI (MN11.25), 03_ATSAM3X_LFBGA217 (MN5.C4)
PB23: 08_SERIAL & USER INTERF (J16.20), 03_ATSAM3X_LFBGA217 (MN5.A3), 02_POWER SUPPLY & USB & (BP4.3 BP4.4)
PB24: 08_SERIAL & USER INTERF (J16.22), 05_DISPLAY & QTouch (JP10.1), 03_ATSAM3X_LFBGA217 (MN5.B3)
PB25: 08_SERIAL & USER INTERF (J16.24 R113.1 R122.1), 03_ATSAM3X_LFBGA217 (MN5.C3)
PB26: 08_SERIAL & USER INTERF (J16.26 R110.1 R123.1), 03_ATSAM3X_LFBGA217 (MN5.A1)
PB27: 08_SERIAL & USER INTERF (J16.28), 05_DISPLAY & QTouch (R60.1), 03_ATSAM3X_LFBGA217 (MN5.N15)
PB28: 08_SERIAL & USER INTERF (J16.30), 03_ATSAM3X_LFBGA217 (MN5.K4), 02_POWER SUPPLY & USB & (J2.9 J2.11 R19.2)
PB29: 08_SERIAL & USER INTERF (J16.32), 03_ATSAM3X_LFBGA217 (MN5.L1), 02_POWER SUPPLY & USB & (J2.5 R20.2)
PB30: 08_SERIAL & USER INTERF (J16.34), 03_ATSAM3X_LFBGA217 (MN5.L3), 02_POWER SUPPLY & USB & (J2.13)
PB31: 08_SERIAL & USER INTERF (J16.36), 03_ATSAM3X_LFBGA217 (MN5.N4), 02_POWER SUPPLY & USB & (J2.7 R21.2)
PC0: 08_SERIAL & USER INTERF (J14.5), 03_ATSAM3X_LFBGA217 (JP6.1 MN5.C8)
PC1: 08_SERIAL & USER INTERF (J14.7), 03_ATSAM3X_LFBGA217 (MN5.R7)
PC2: 08_SERIAL & USER INTERF (J14.9), 05_DISPLAY & QTouch (J4.6), 04_EBI_MEMORY (MN7.2 MN8.29), 03_ATSAM3X_LFBGA217 (MN5.T7)
PC3: 08_SERIAL & USER INTERF (J14.11), 05_DISPLAY & QTouch (J4.7), 04_EBI_MEMORY (MN7.4 MN8.30), 03_ATSAM3X_LFBGA217 (MN5.R8)
PC4: 08_SERIAL & USER INTERF (J14.13), 05_DISPLAY & QTouch (J4.8), 04_EBI_MEMORY (MN7.5 MN8.31), 03_ATSAM3X_LFBGA217 (MN5.C14)
PC5: 08_SERIAL & USER INTERF (J14.15), 05_DISPLAY & QTouch (J4.9), 04_EBI_MEMORY (MN7.7 MN8.32), 03_ATSAM3X_LFBGA217 (MN5.N14)
PC6: 08_SERIAL & USER INTERF (J14.17), 05_DISPLAY & QTouch (J4.10), 04_EBI_MEMORY (MN7.8 MN8.41), 03_ATSAM3X_LFBGA217 (MN5.P14)
PC7: 08_SERIAL & USER INTERF (J14.19), 05_DISPLAY & QTouch (J4.11), 04_EBI_MEMORY (MN7.10 MN8.42), 03_ATSAM3X_LFBGA217 (MN5.R13)
PC8: 08_SERIAL & USER INTERF (J14.21), 05_DISPLAY & QTouch (J4.12), 04_EBI_MEMORY (MN7.11 MN8.43), 03_ATSAM3X_LFBGA217 (MN5.T13)
PC9: 08_SERIAL & USER INTERF (J14.23), 05_DISPLAY & QTouch (J4.13), 04_EBI_MEMORY (MN7.13 MN8.44), 03_ATSAM3X_LFBGA217 (MN5.U13)
PC10: 08_SERIAL & USER INTERF (J14.25), 05_DISPLAY & QTouch (J4.14), 04_EBI_MEMORY (MN7.42 MN8.26), 03_ATSAM3X_LFBGA217 (MN5.B14)
PC11: 08_SERIAL & USER INTERF (J14.27), 05_DISPLAY & QTouch (J4.15), 04_EBI_MEMORY (MN7.44 MN8.27), 03_ATSAM3X_LFBGA217 (MN5.M15)
PC12: 08_SERIAL & USER INTERF (J14.29), 05_DISPLAY & QTouch (J4.16), 04_EBI_MEMORY (MN7.45 MN8.28), 03_ATSAM3X_LFBGA217 (MN5.L14)
PC13: 08_SERIAL & USER INTERF (J14.31), 05_DISPLAY & QTouch (J4.17), 04_EBI_MEMORY (MN7.47 MN8.33), 03_ATSAM3X_LFBGA217 (MN5.L15)
PC14: 08_SERIAL & USER INTERF (J14.33), 05_DISPLAY & QTouch (J4.18), 04_EBI_MEMORY (MN7.48 MN8.40), 03_ATSAM3X_LFBGA217 (MN5.K15)
PC15: 08_SERIAL & USER INTERF (J14.35), 05_DISPLAY & QTouch (J4.19), 04_EBI_MEMORY (MN7.50 MN8.45), 03_ATSAM3X_LFBGA217 (MN5.K14)
PC16: 08_SERIAL & USER INTERF (J14.6), 05_DISPLAY & QTouch (J4.20), 04_EBI_MEMORY (MN7.51 MN8.46), 03_ATSAM3X_LFBGA217 (MN5.J14)
PC17: 08_SERIAL & USER INTERF (J14.8), 05_DISPLAY & QTouch (J4.21), 04_EBI_MEMORY (MN7.53 MN8.47), 03_ATSAM3X_LFBGA217 (MN5.J17)
PC18: 08_SERIAL & USER INTERF (J14.10), 05_DISPLAY & QTouch (J4.4), 03_ATSAM3X_LFBGA217 (MN5.J16)
PC19: 08_SERIAL & USER INTERF (J14.12), 04_EBI_MEMORY (MN8.8), 03_ATSAM3X_LFBGA217 (MN5.J15)
PC20: 08_SERIAL & USER INTERF (J14.14), 04_EBI_MEMORY (MN8.18), 03_ATSAM3X_LFBGA217 (MN5.C7)
PC21: 08_SERIAL & USER INTERF (J14.16), 04_EBI_MEMORY (MN7.15), 03_ATSAM3X_LFBGA217 (MN5.A6)
PC22: 08_SERIAL & USER INTERF (J14.18), 05_DISPLAY & QTouch (J4.3), 03_ATSAM3X_LFBGA217 (MN5.D7)
PC23: 08_SERIAL & USER INTERF (J14.20), 04_EBI_MEMORY (MN7.23), 03_ATSAM3X_LFBGA217 (MN5.B6)
PC24: 08_SERIAL & USER INTERF (J14.22), 04_EBI_MEMORY (MN7.24), 03_ATSAM3X_LFBGA217 (MN5.C6)
PC25: 08_SERIAL & USER INTERF (J14.24), 04_EBI_MEMORY (MN7.25), 03_ATSAM3X_LFBGA217 (MN5.A5)
PC26: 08_SERIAL & USER INTERF (J14.26), 04_EBI_MEMORY (MN7.26), 03_ATSAM3X_LFBGA217 (MN5.B5)
PC27: 08_SERIAL & USER INTERF (J14.28), 04_EBI_MEMORY (MN7.29), 03_ATSAM3X_LFBGA217 (MN5.C5)
PC28: 08_SERIAL & USER INTERF (J14.30), 04_EBI_MEMORY (MN7.30), 03_ATSAM3X_LFBGA217 (MN5.A4)
PC29: 08_SERIAL & USER INTERF (J14.32), 04_EBI_MEMORY (MN7.31), 03_ATSAM3X_LFBGA217 (MN5.H17)
PC30: 08_SERIAL & USER INTERF (J14.34), 04_EBI_MEMORY (MN7.32), 03_ATSAM3X_LFBGA217 (MN5.H16)
PD0: 08_SERIAL & USER INTERF (J19.5), 06_Audio & HSMCI & TWI (J8.3 RR1.6), 03_ATSAM3X_LFBGA217 (MN5.E3)
PD1: 08_SERIAL & USER INTERF (J19.7), 06_Audio & HSMCI & TWI (J8.5 RR1.5), 03_ATSAM3X_LFBGA217 (MN5.E2)
PD2: 08_SERIAL & USER INTERF (J19.9), 06_Audio & HSMCI & TWI (J8.9 RR2.8), 03_ATSAM3X_LFBGA217 (MN5.E1)
PD3: 08_SERIAL & USER INTERF (J19.11), 06_Audio & HSMCI & TWI (J8.11 RR2.7), 03_ATSAM3X_LFBGA217 (MN5.F4)
PD4: 08_SERIAL & USER INTERF (J19.13), 04_EBI_MEMORY (MN7.36), 03_ATSAM3X_LFBGA217 (MN5.F3)
PD5: 08_SERIAL & USER INTERF (J19.15), 03_ATSAM3X_LFBGA217 (MN5.F2)
PD6: 08_SERIAL & USER INTERF (J19.17), 04_EBI_MEMORY (MN7.20), 03_ATSAM3X_LFBGA217 (MN5.F1)
PD7: 08_SERIAL & USER INTERF (J19.19), 04_EBI_MEMORY (MN7.21), 03_ATSAM3X_LFBGA217 (MN5.G4)
PD8: 08_SERIAL & USER INTERF (J19.21), 04_EBI_MEMORY (MN8.17), 03_ATSAM3X_LFBGA217 (MN5.H2)
PD9: 08_SERIAL & USER INTERF (J19.23), 04_EBI_MEMORY (MN8.16), 03_ATSAM3X_LFBGA217 (MN5.J2)
PD10: 08_SERIAL & USER INTERF (J19.25), 04_EBI_MEMORY (MN7.39), 03_ATSAM3X_LFBGA217 (MN5.P4)
PD11: 08_SERIAL & USER INTERF (J19.27), 04_EBI_MEMORY (MN7.22), 03_ATSAM3X_LFBGA217 (MN5.P9)
PD12: 08_SERIAL & USER INTERF (J19.29), 04_EBI_MEMORY (JP9.2), 03_ATSAM3X_LFBGA217 (MN5.R9)
PD13: 08_SERIAL & USER INTERF (J19.31), 04_EBI_MEMORY (MN7.37), 03_ATSAM3X_LFBGA217 (MN5.T9)
PD14: 08_SERIAL & USER INTERF (J19.33), 04_EBI_MEMORY (MN7.16), 03_ATSAM3X_LFBGA217 (MN5.U9)
PD15: 08_SERIAL & USER INTERF (J19.35), 04_EBI_MEMORY (MN7.18), 03_ATSAM3X_LFBGA217 (MN5.U10)
PD16: 08_SERIAL & USER INTERF (J19.6), 04_EBI_MEMORY (MN7.17), 03_ATSAM3X_LFBGA217 (MN5.R10)
PD17: 08_SERIAL & USER INTERF (J19.8), 07_ETHERNET & ZIGBEE (R84.1 Y3.1), 03_ATSAM3X_LFBGA217 (MN5.R11)
PD18: 08_SERIAL & USER INTERF (J19.10), 03_ATSAM3X_LFBGA217 (MN5.T11)
PD19: 08_SERIAL & USER INTERF (J19.12), 03_ATSAM3X_LFBGA217 (MN5.U11)
PD20: 08_SERIAL & USER INTERF (J19.14), 03_ATSAM3X_LFBGA217 (MN5.P12)
PD21: 08_SERIAL & USER INTERF (J19.16), 03_ATSAM3X_LFBGA217 (MN5.P13)
PD22: 08_SERIAL & USER INTERF (J19.18), 04_EBI_MEMORY (MN7.33), 03_ATSAM3X_LFBGA217 (MN5.R12)
PD23: 08_SERIAL & USER INTERF (J19.20), 04_EBI_MEMORY (MN7.34), 03_ATSAM3X_LFBGA217 (MN5.T12)
PD24: 08_SERIAL & USER INTERF (J19.22), 03_ATSAM3X_LFBGA217 (MN5.U12)
PD25: 08_SERIAL & USER INTERF (J19.24), 04_EBI_MEMORY (MN7.35), 03_ATSAM3X_LFBGA217 (MN5.H15)
PD26: 08_SERIAL & USER INTERF (J19.26), 03_ATSAM3X_LFBGA217 (MN5.G17)
PD27: 08_SERIAL & USER INTERF (J19.28), 03_ATSAM3X_LFBGA217 (MN5.G16)
PD28: 08_SERIAL & USER INTERF (J19.30), 03_ATSAM3X_LFBGA217 (MN5.G15)
PD29: 08_SERIAL & USER INTERF (J19.32), 03_ATSAM3X_LFBGA217 (MN5.F17)
PD30: 08_SERIAL & USER INTERF (J19.34), 03_ATSAM3X_LFBGA217 (MN5.F16)
PE0: 08_SERIAL & USER INTERF (J18.5), 03_ATSAM3X_LFBGA217 (MN5.E17)
PE1: 08_SERIAL & USER INTERF (J18.7), 03_ATSAM3X_LFBGA217 (MN5.F14)
PE2: 08_SERIAL & USER INTERF (J18.9), 03_ATSAM3X_LFBGA217 (MN5.E16)
PE3: 08_SERIAL & USER INTERF (J18.11), 03_ATSAM3X_LFBGA217 (MN5.E15)
PE4: 08_SERIAL & USER INTERF (J18.13), 03_ATSAM3X_LFBGA217 (MN5.D17)
PE5: 08_SERIAL & USER INTERF (J18.15), 03_ATSAM3X_LFBGA217 (MN5.D16), 02_POWER SUPPLY & USB & (MN4.2 R8.1)
PE6: 08_SERIAL & USER INTERF (J18.17), 06_Audio & HSMCI & TWI (J8.10 R81.2), 03_ATSAM3X_LFBGA217 (MN5.E14)
PE7: 08_SERIAL & USER INTERF (J18.19), 03_ATSAM3X_LFBGA217 (MN5.D15), 02_POWER SUPPLY & USB & (BP5.3 BP5.4)
PE8: 08_SERIAL & USER INTERF (J18.21), 03_ATSAM3X_LFBGA217 (MN5.C17)
PE9: 08_SERIAL & USER INTERF (J18.23), 07_ETHERNET & ZIGBEE (R102.1), 03_ATSAM3X_LFBGA217 (MN5.A12)
PE10: 08_SERIAL & USER INTERF (J18.25), 07_ETHERNET & ZIGBEE (R105.2), 03_ATSAM3X_LFBGA217 (MN5.C11)
PE11: 08_SERIAL & USER INTERF (J18.27), 07_ETHERNET & ZIGBEE (R103.2), 03_ATSAM3X_LFBGA217 (MN5.B11)
PE12: 08_SERIAL & USER INTERF (J18.29), 07_ETHERNET & ZIGBEE (R104.1), 03_ATSAM3X_LFBGA217 (MN5.A11)
PE13: 08_SERIAL & USER INTERF (J18.31), 03_ATSAM3X_LFBGA217 (MN5.C10)
PE14: 08_SERIAL & USER INTERF (J18.33 R119.1), 03_ATSAM3X_LFBGA217 (MN5.B10)
PE15: 08_SERIAL & USER INTERF (J18.35 R134.1), 03_ATSAM3X_LFBGA217 (MN5.A10)
PE16: 08_SERIAL & USER INTERF (J18.6 R136.1), 03_ATSAM3X_LFBGA217 (MN5.B8)
PE17: 08_SERIAL & USER INTERF (J18.8), 03_ATSAM3X_LFBGA217 (MN5.A8)
PE18: 05_DISPLAY & QTouch (C65.2), 03_ATSAM3X_LFBGA217 (MN5.A7)
PE19: 05_DISPLAY & QTouch (C65.1 R43.1), 03_ATSAM3X_LFBGA217 (MN5.B7)
PE20: 05_DISPLAY & QTouch (C60.2), 03_ATSAM3X_LFBGA217 (MN5.D8)
PE21: 05_DISPLAY & QTouch (C60.1 R38.1), 03_ATSAM3X_LFBGA217 (MN5.D4)
PE22: 05_DISPLAY & QTouch (C68.2), 03_ATSAM3X_LFBGA217 (MN5.D5)
PE23: 05_DISPLAY & QTouch (C68.1 R48.1), 03_ATSAM3X_LFBGA217 (MN5.D6)
PE24: 05_DISPLAY & QTouch (C64.2), 03_ATSAM3X_LFBGA217 (MN5.A2)
PE25: 05_DISPLAY & QTouch (C64.1 R42.1), 03_ATSAM3X_LFBGA217 (MN5.B12)
PE26: 05_DISPLAY & QTouch (C62.2), 03_ATSAM3X_LFBGA217 (MN5.G3)
PE27: 05_DISPLAY & QTouch (C62.1 R40.1), 03_ATSAM3X_LFBGA217 (MN5.G2)
PE28: 08_SERIAL & USER INTERF (J18.30), 07_ETHERNET & ZIGBEE (J10.7), 03_ATSAM3X_LFBGA217 (MN5.G1)
PE29: 08_SERIAL & USER INTERF (J18.32), 07_ETHERNET & ZIGBEE (J10.6), 03_ATSAM3X_LFBGA217 (MN5.H3)
PE30: 08_SERIAL & USER INTERF (J18.34), 07_ETHERNET & ZIGBEE (J10.8), 03_ATSAM3X_LFBGA217 (MN5.H1)
PE31: 08_SERIAL & USER INTERF (J18.36), 07_ETHERNET & ZIGBEE (J10.5), 03_ATSAM3X_LFBGA217 (MN5.F15)
PF0: 05_DISPLAY & QTouch (C59.2), 03_ATSAM3X_LFBGA217 (MN5.D12)
PF1: 05_DISPLAY & QTouch (C59.1 R37.1), 03_ATSAM3X_LFBGA217 (MN5.L2)
PF2: 05_DISPLAY & QTouch (C61.2), 03_ATSAM3X_LFBGA217 (MN5.M1)
PF3: 05_DISPLAY & QTouch (C61.1 R39.1), 03_ATSAM3X_LFBGA217 (MN5.M2)
PF4: 05_DISPLAY & QTouch (C63.2), 03_ATSAM3X_LFBGA217 (MN5.M3)
PF5: 05_DISPLAY & QTouch (C63.1 R41.1), 03_ATSAM3X_LFBGA217 (MN5.M4)
SDCK: 04_EBI_MEMORY (MN7.38), 03_ATSAM3X_LFBGA217 (MN5.D11)
SHDN: 03_ATSAM3X_LFBGA217 (MN5.T5), 02_POWER SUPPLY & USB & (R7.1)
VBUS: 03_ATSAM3X_LFBGA217 (MN5.U4), 02_POWER SUPPLY & USB & (5 pins)
VDDANA: 03_ATSAM3X_LFBGA217 (C49.1 MN5.T14), 02_POWER SUPPLY & USB & (JP1.12)
VDDBU: 03_ATSAM3X_LFBGA217 (C45.1 MN5.P8 R139.1 R140.1), 02_POWER SUPPLY & USB & (C22.2 JP2.1 R23.2)
VDDCORE: 03_ATSAM3X_LFBGA217 (12 pins), 02_POWER SUPPLY & USB & (JP1.4)
VDDIN: 03_ATSAM3X_LFBGA217 (MN5.U8), 02_POWER SUPPLY & USB & (C14.1 JP1.10)
VDDIO: 03_ATSAM3X_LFBGA217 (11 pins), 02_POWER SUPPLY & USB & (C12.1 JP1.2)
VDDOUT: 03_ATSAM3X_LFBGA217 (MN5.U7), 02_POWER SUPPLY & USB & (C15.1 C18.1 JP1.3 L3.2)
VDDPLL: 03_ATSAM3X_LFBGA217 (C41.1 MN5.N1), 02_POWER SUPPLY & USB & (JP1.6)
VDDUTMI: 03_ATSAM3X_LFBGA217 (C43.1 MN5.T3), 02_POWER SUPPLY & USB & (JP1.8)